# EAGLE board ControlBoard00_v04_NewNetNamesNewBackplanes (EAGLE 7.7.0), part 1 of 3
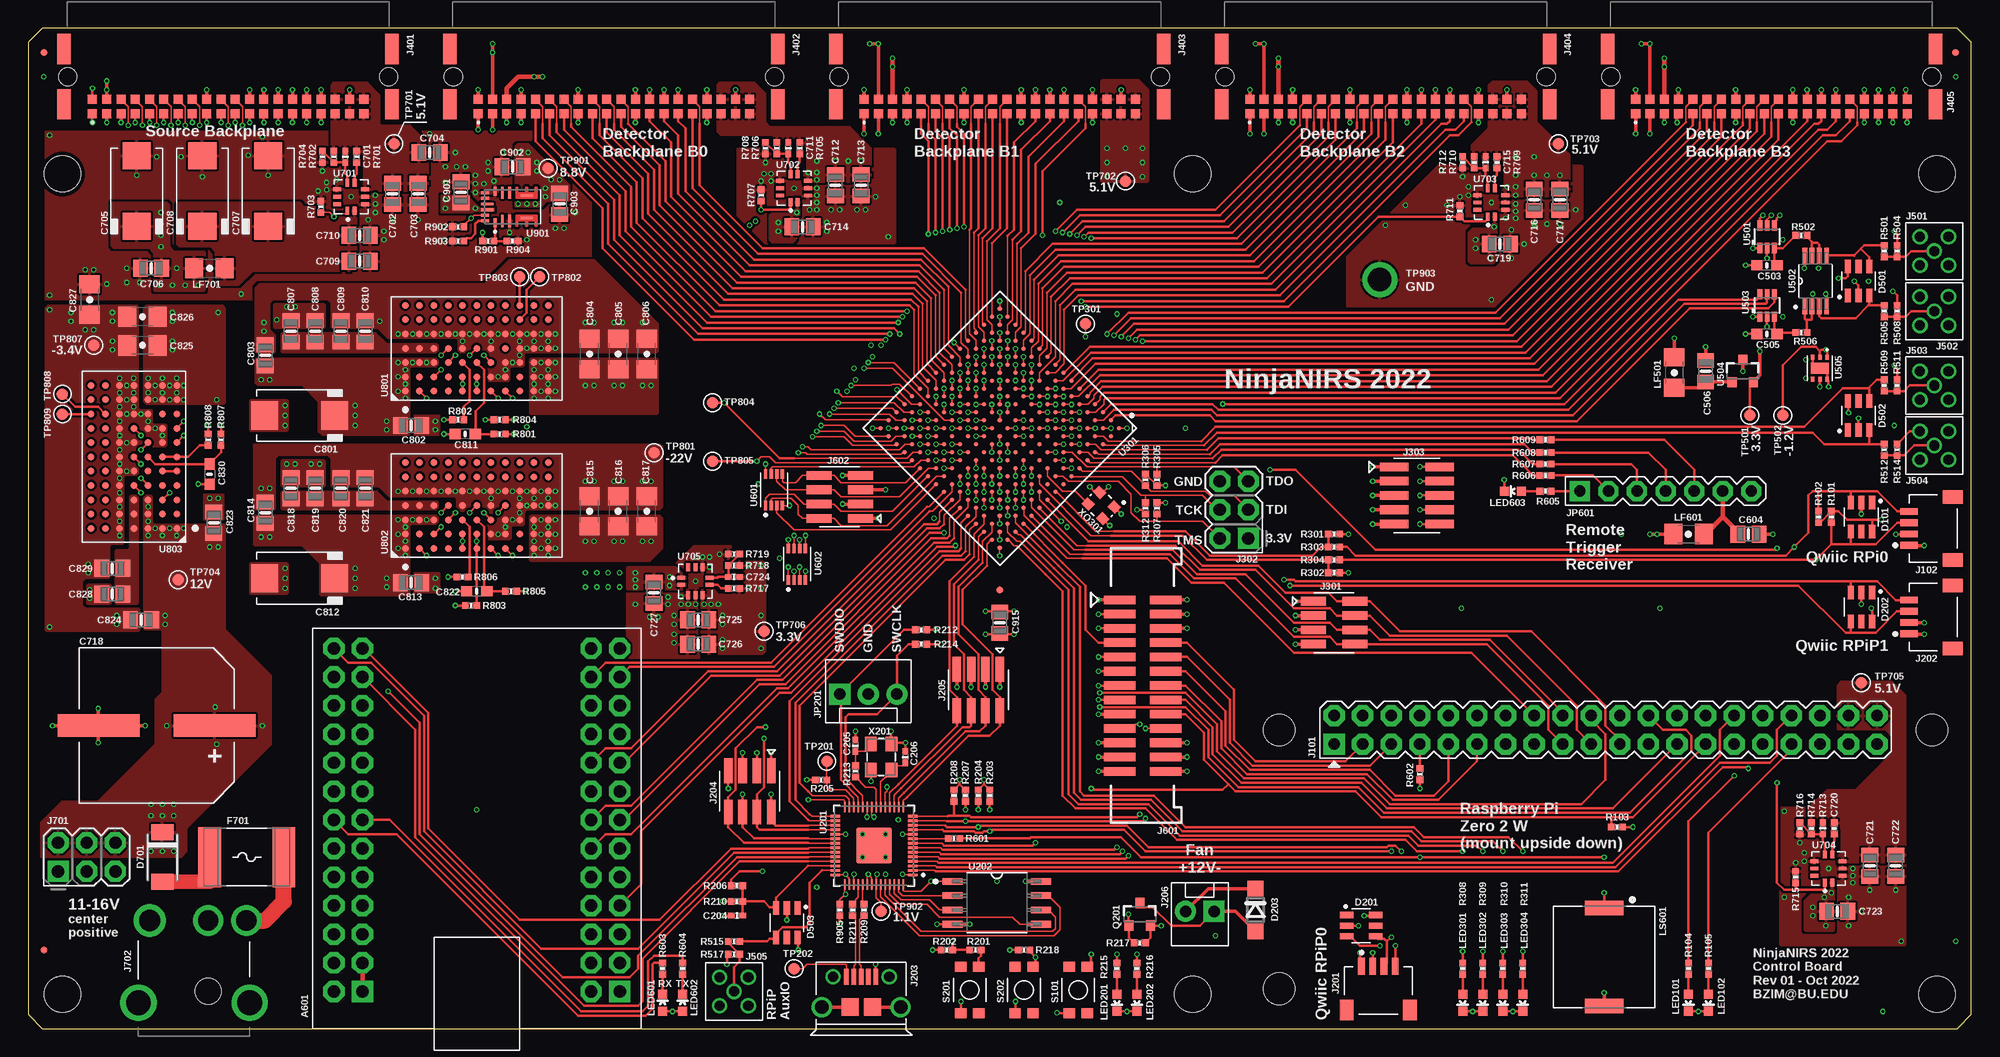
[diagram p9: board, top side]
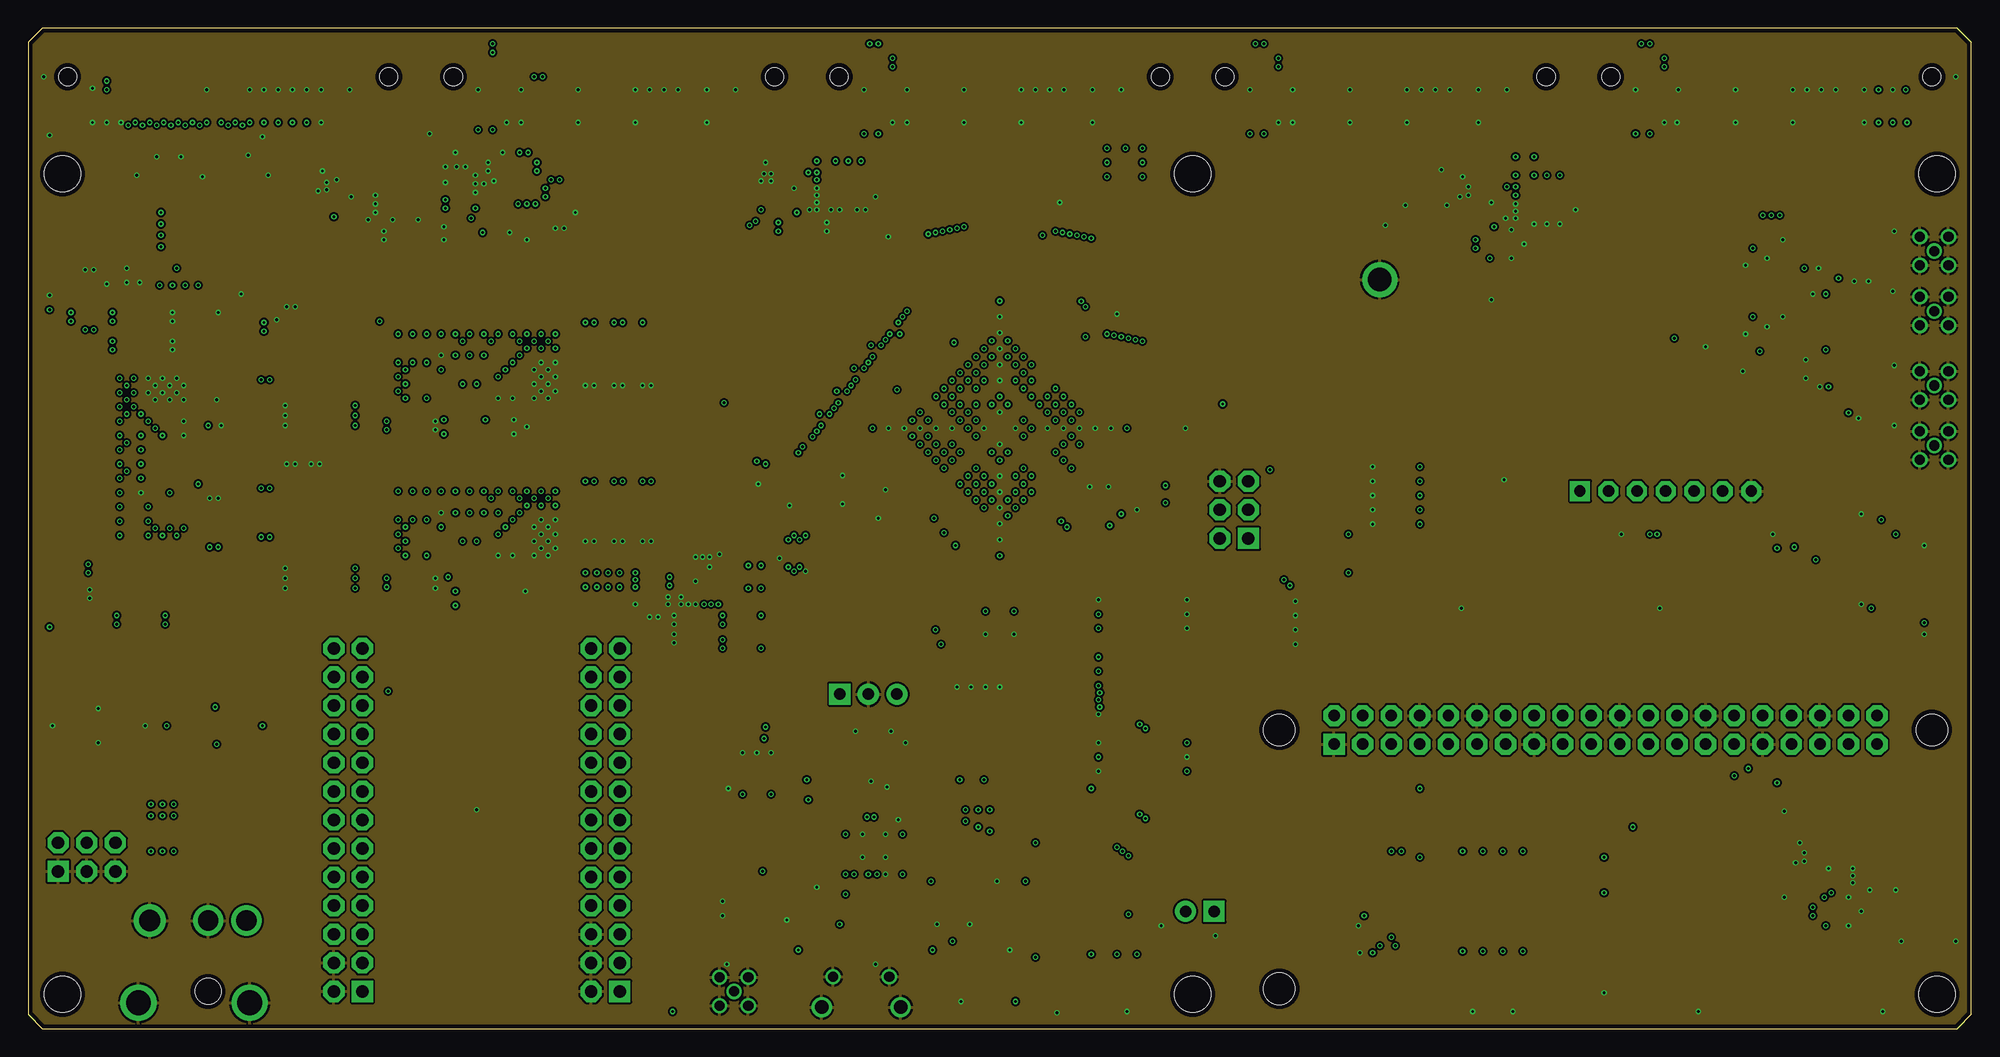
[diagram p10: board, inner layer Route2]
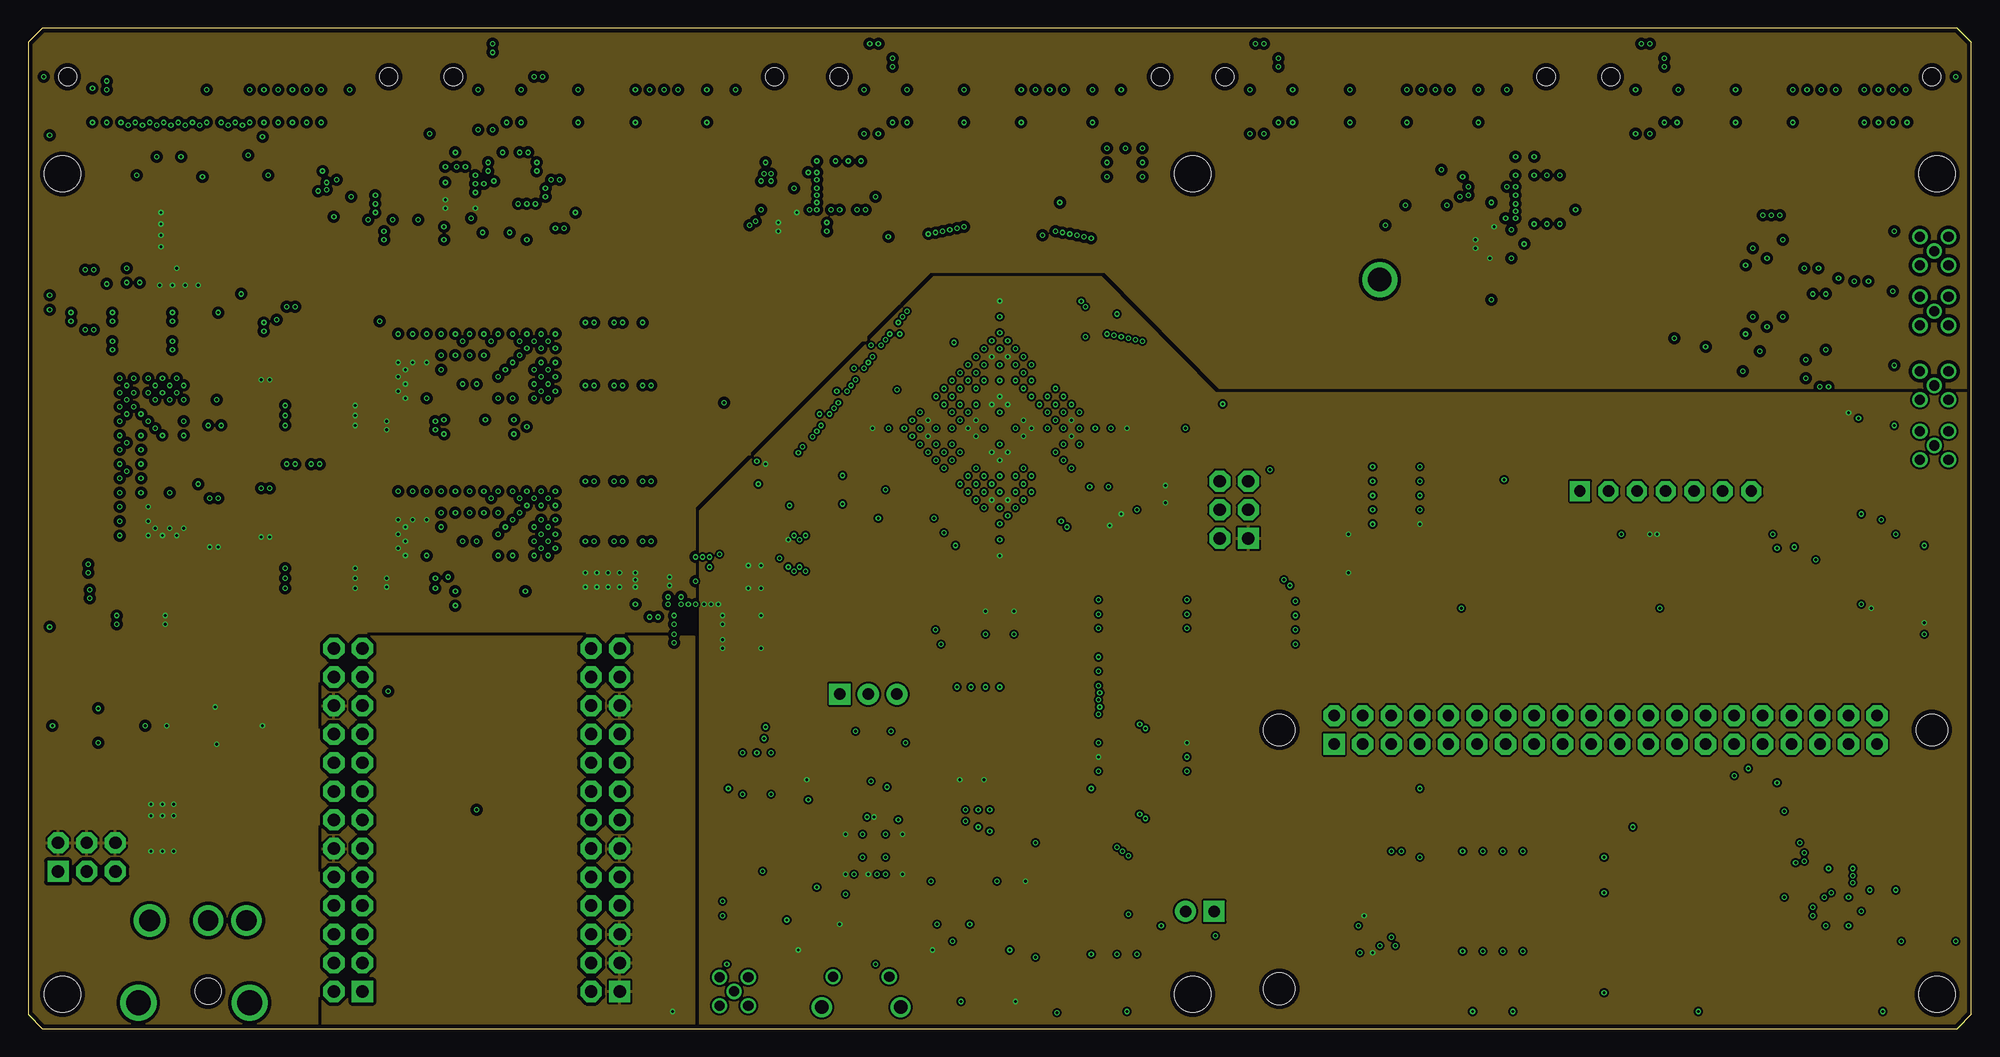
[diagram p11: board, inner layer Route3]
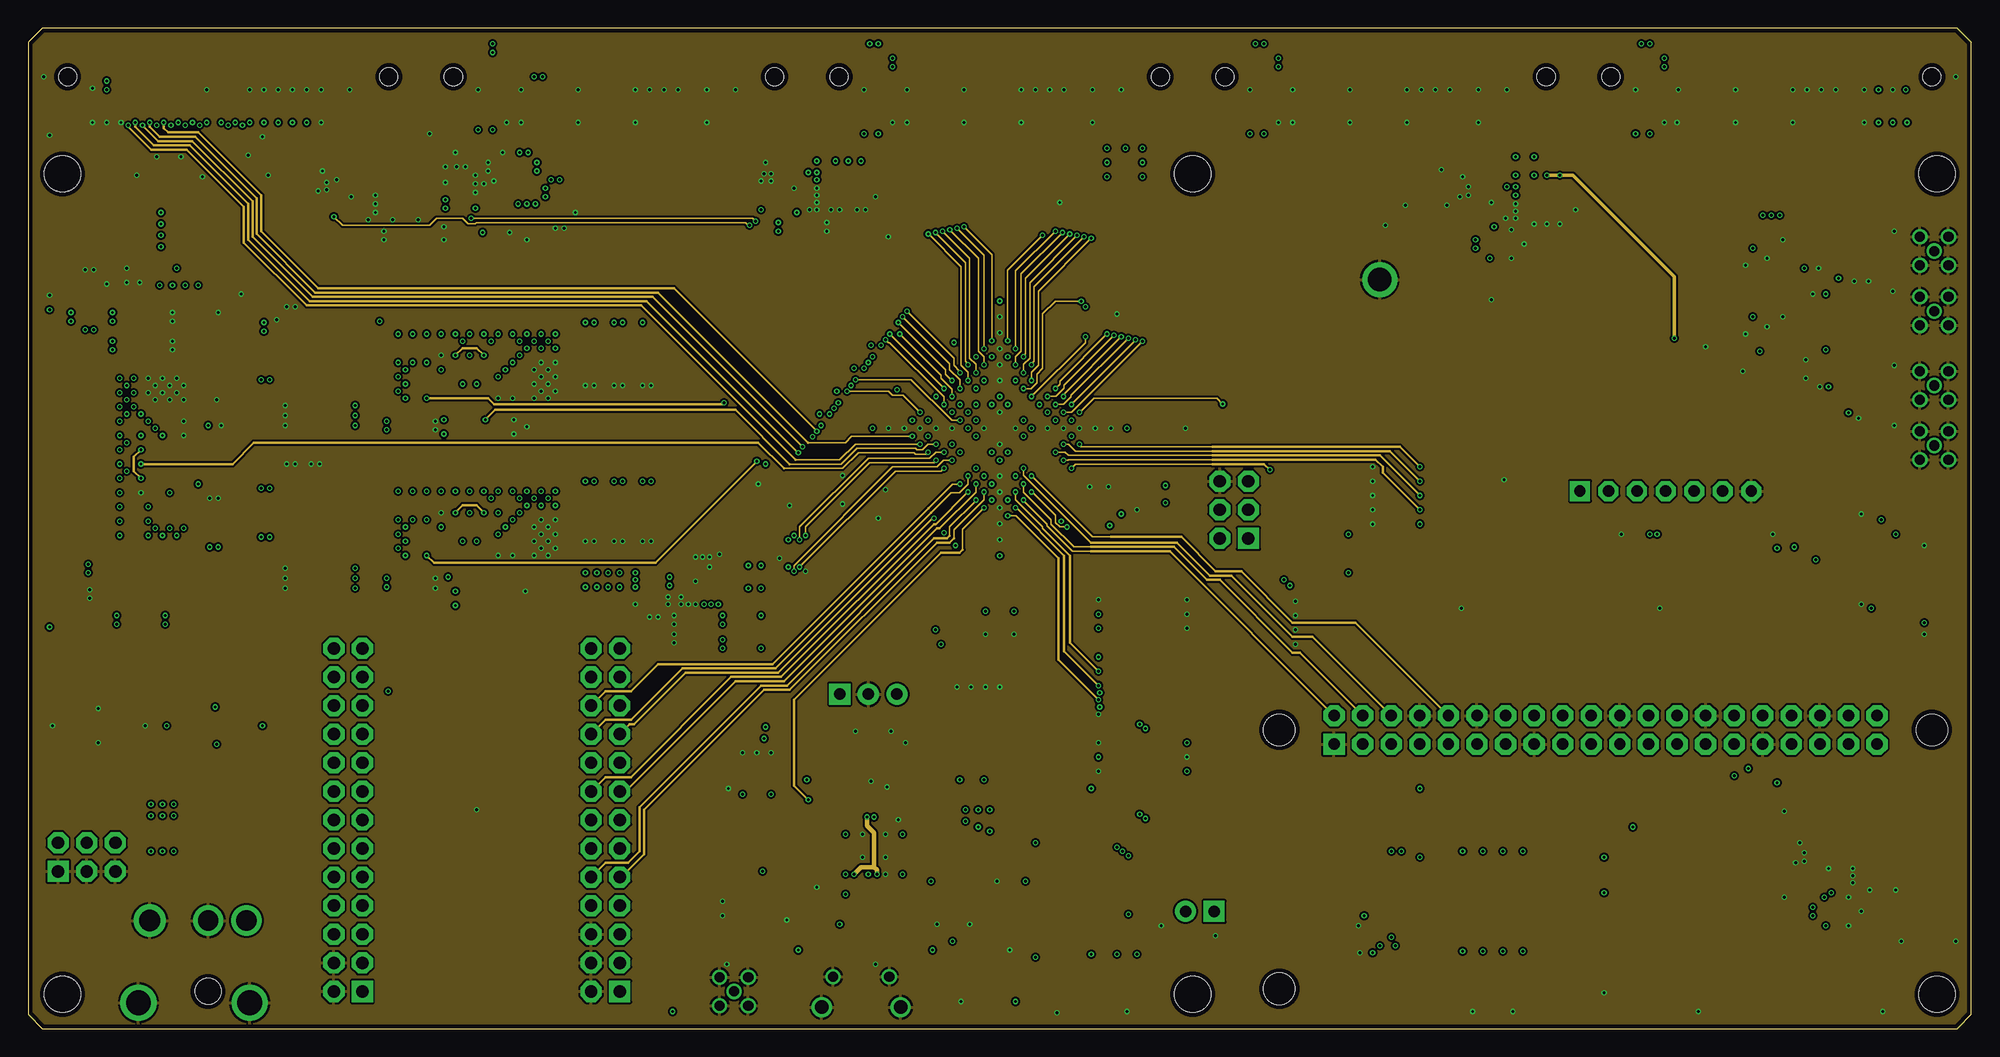
[diagram p12: board, inner layer Route14]
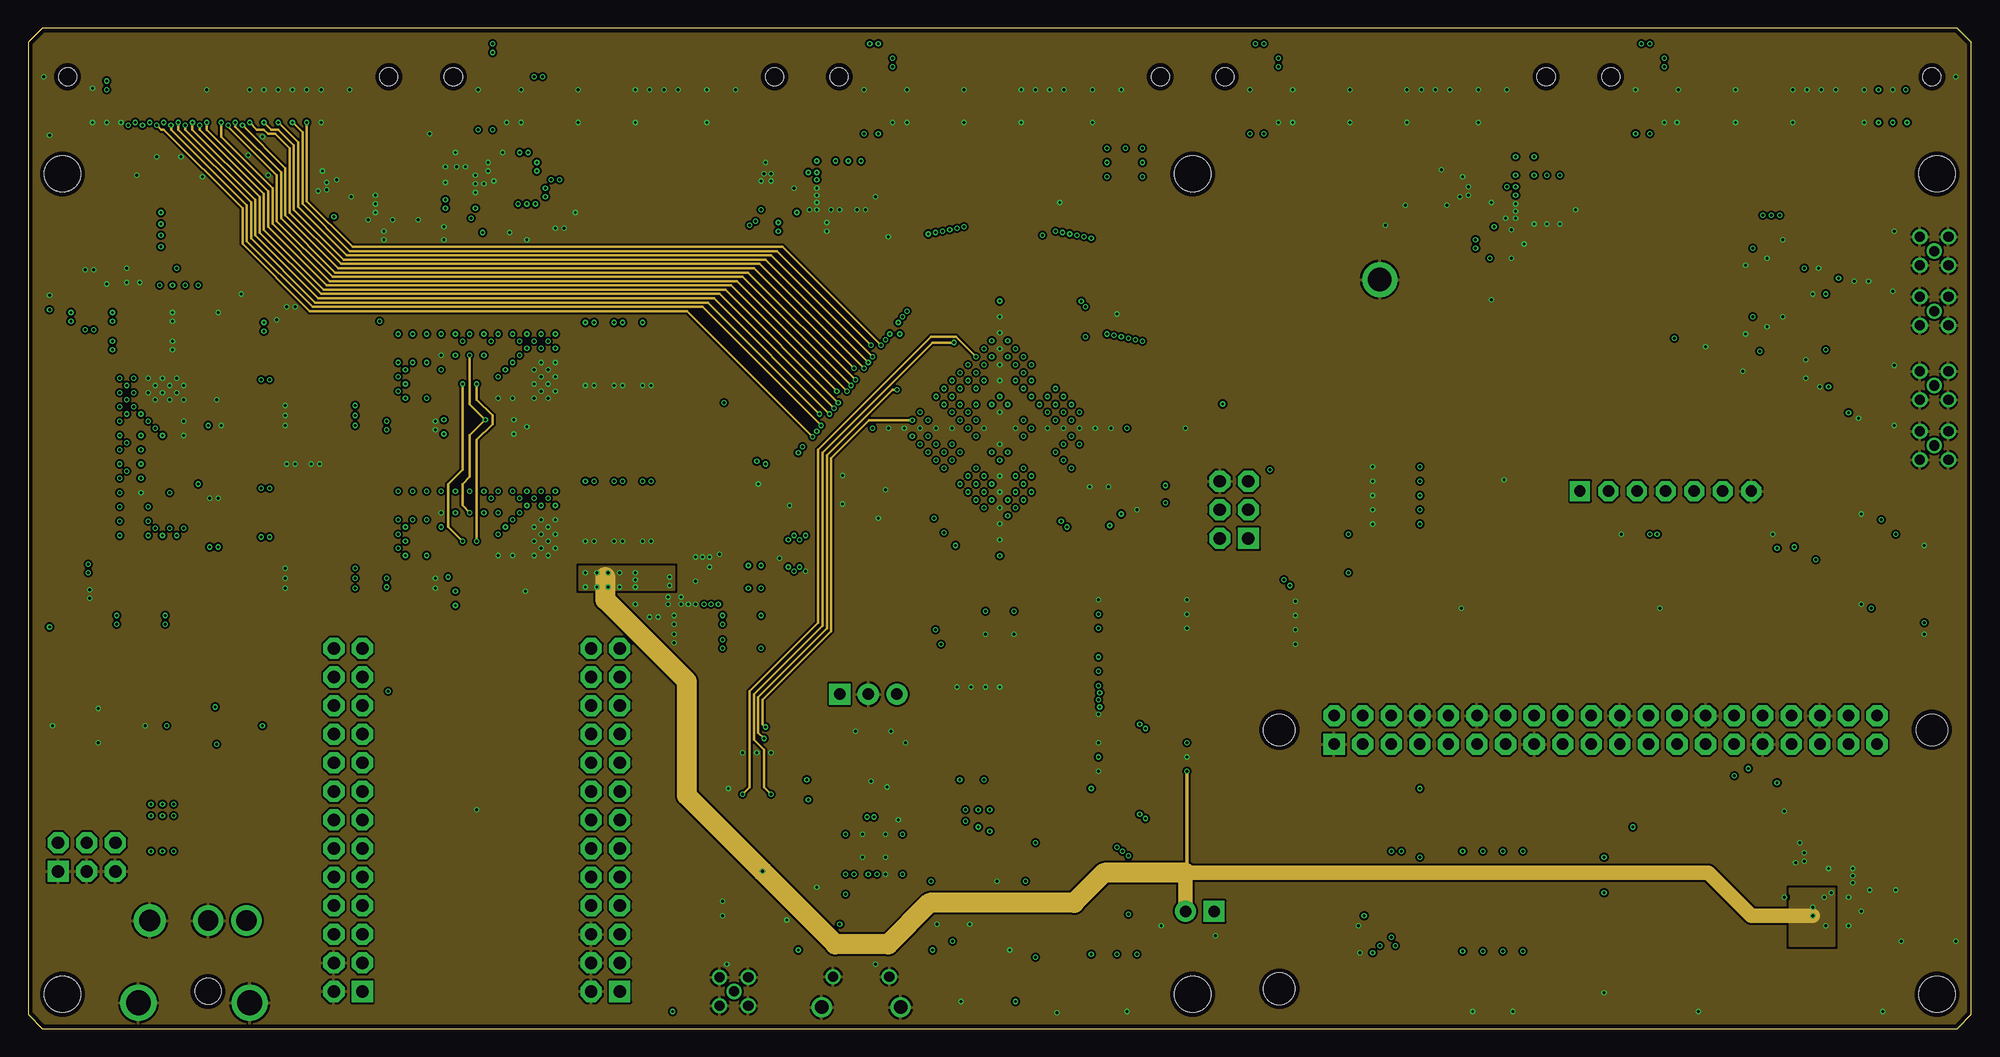
[diagram p13: board, inner layer Route15]
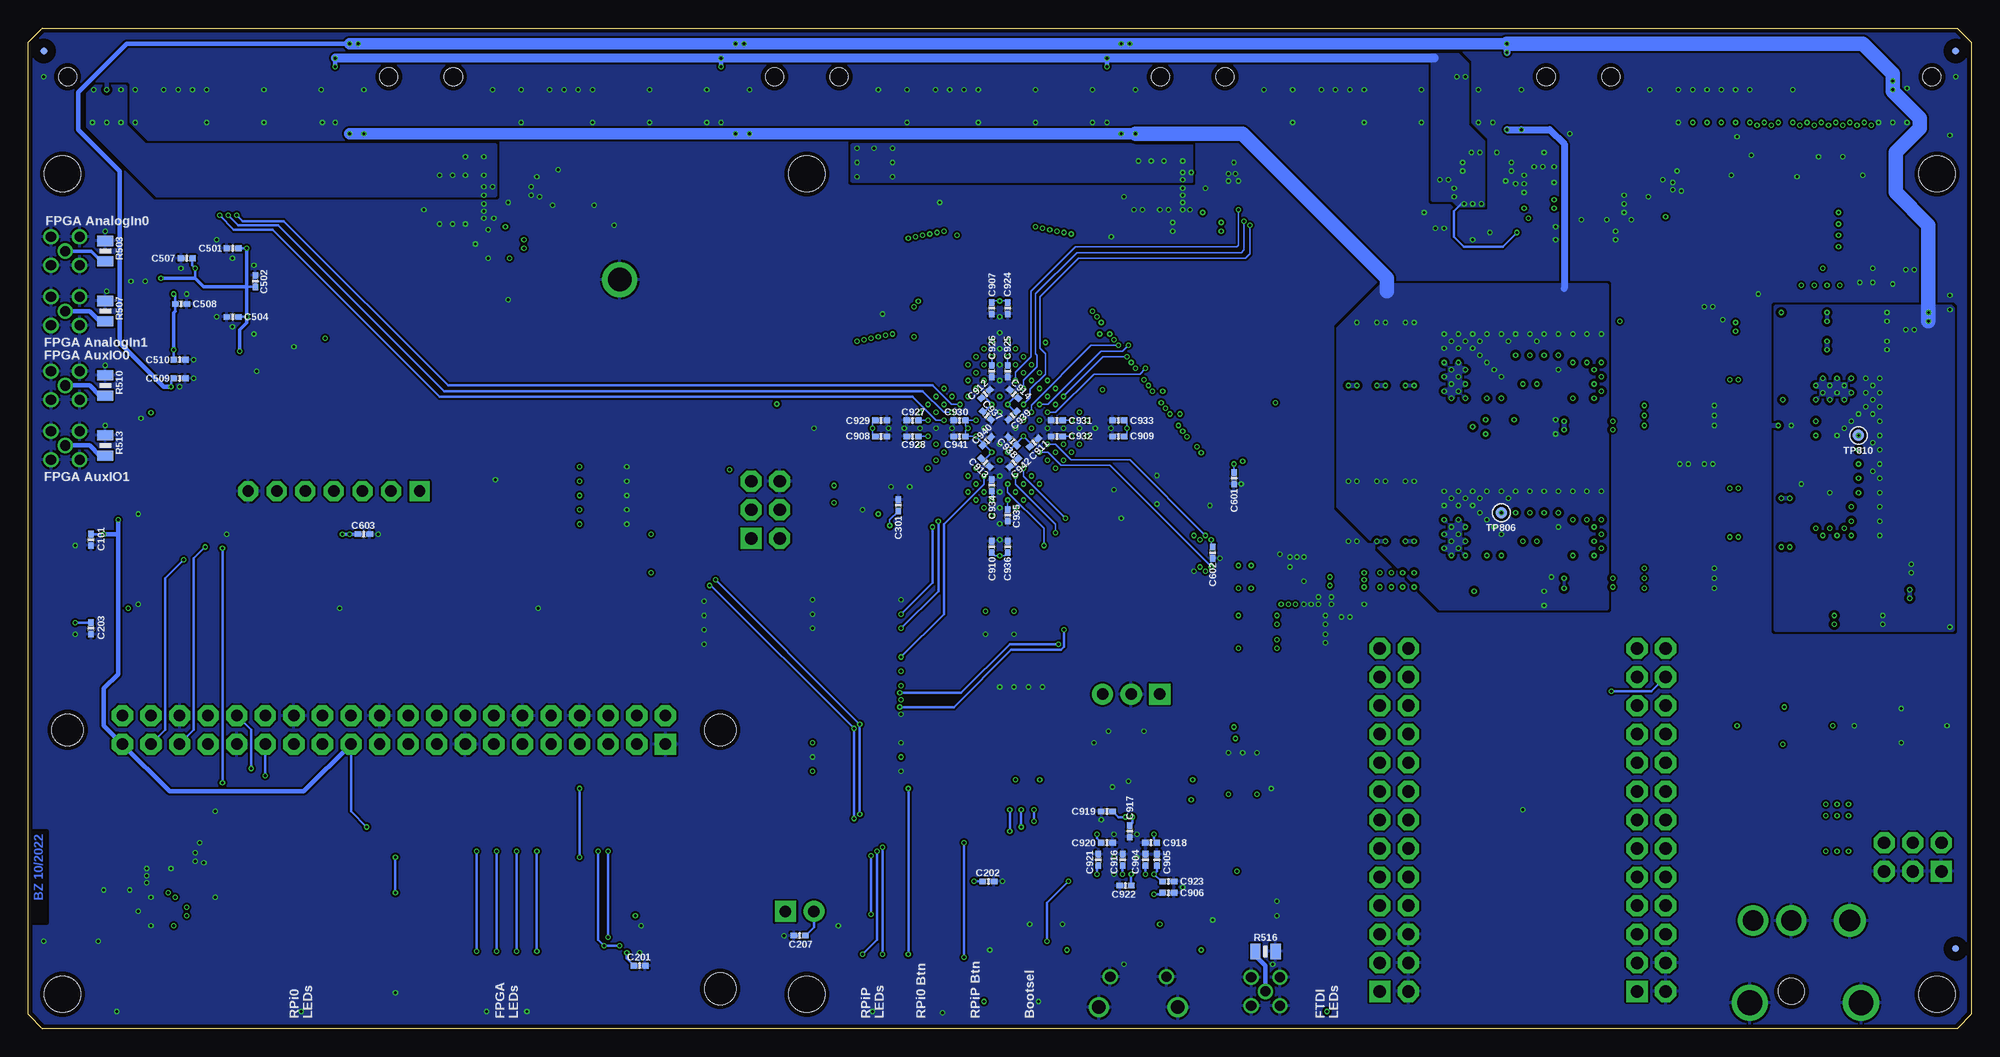
[diagram p14: board, bottom side, seen from below]

Size 172.72 x 88.9 mm. Coordinates in mm from the lower left corner, seen from the top.
Outline: 1.27,0 171.45,0 172.72,1.27 172.72,87.63 171.45,88.9 1.27,88.9 0,87.63 0,1.27 1.27,0
Copper layers (1*2*3*14*15*16): Top 0.04318125mm / dielectric 0.11074375mm / Route2 0.017271875mm / dielectric 4mil / Route3 0.017271875mm / dielectric 0.925575mm / Route14 0.017271875mm / dielectric 4mil / Route15 0.017271875mm / dielectric 0.11074375mm / Bottom 0.04318125mm
Design rules "ControlBoard00_v01_DRCsnapshot": minimum track width 5mil, minimum drill 10mil, track to track 5mil, track to pad 5mil, pad to pad 5mil, via to via 5mil, smd to smd 5mil, copper to edge 15mil, drill to drill 6mil, minimum pad ring 4mil, minimum via ring 4mil, stop-mask expansion 1.5mil, vias tented up to drill 12mil, thermal gap 8mil
Holes 3.2 mm at 3.05,3.05 169.67,3.05 103.5,3.05 3.05,75.95 103.5,75.95 169.67,75.95
Holes 2.8 mm at 111.21,26.54 169.21,26.54 111.21,3.54
tKeepout: area 100.5,72.9 to 106.6,79; area 166.6,72.9 to 172.7,79; area 0,72.9 to 6.1,79; area 0,0 to 6.1,6.1; area 100.5,0 to 106.6,6.1; area 166.6,0 to 172.7,6.1
tRestrict: 33 lines
bRestrict: 3 lines

## Footprints (pad centres in the part's own frame; a part is rotated, then mirrored left to right if it is on the bottom)
FT2232H-MINIMOD = drill 1.1 pad 1.88 square: CN2-1 -15.24,-12.7; CN3-1 -15.24,10.16 | drill 1.1 pad 1.88 octagon: CN2-2 -15.24,-10.16; CN2-3 -12.7,-12.7; CN2-4 -12.7,-10.16; CN2-5 -10.16,-12.7; CN2-6 -10.16,-10.16; CN2-7 -7.62,-12.7; CN2-8 -7.62,-10.16; CN2-9 -5.08,-12.7; CN2-10 -5.08,-10.16; CN2-11 -2.54,-12.7; CN2-12 -2.54,-10.16; CN2-13 0,-12.7; CN2-14 0,-10.16; CN2-15 2.54,-12.7; CN2-16 2.54,-10.16; CN2-17 5.08,-12.7; CN2-18 5.08,-10.16; CN2-19 7.62,-12.7; CN2-20 7.62,-10.16; CN2-21 10.16,-12.7; CN2-22 10.16,-10.16; CN2-23 12.7,-12.7; CN2-24 12.7,-10.16; CN2-25 15.24,-12.7; CN2-26 15.24,-10.16; CN3-2 -15.24,12.7; CN3-3 -12.7,10.16; CN3-4 -12.7,12.7; CN3-5 -10.16,10.16; CN3-6 -10.16,12.7; CN3-7 -7.62,10.16; CN3-8 -7.62,12.7; CN3-9 -5.08,10.16; CN3-10 -5.08,12.7; CN3-11 -2.54,10.16; CN3-12 -2.54,12.7; CN3-13 0,10.16; CN3-14 0,12.7; CN3-15 2.54,10.16; CN3-16 2.54,12.7; CN3-17 5.08,10.16; CN3-18 5.08,12.7; CN3-19 7.62,10.16; CN3-20 7.62,12.7; CN3-21 10.16,10.16; CN3-22 10.16,12.7; CN3-23 12.7,10.16; CN3-24 12.7,12.7; CN3-25 15.24,10.16; CN3-26 15.24,12.7
0402-CAP = smd 0.6 x 0.5: 1 -0.5,0; 2 0.5,0
0603-CAP = smd 1 x 0.9: 1 -0.9,0; 2 0.9,0
0805-CAP = smd 1.3 x 1.5: 1 -0.95,0; 2 0.95,0
2917-CAP = smd 2.4 x 2.5: N 3.125,0; P -3.125,0
CAP-SMD-POL-12.5 = smd 2 x 7.3: N 0,-5.15; P 0,5.15
1206 = smd 1.6 x 1.8: 1 -1.35,0; 2 1.35,0
SOT23-6 = smd 1.2 x 0.55: 1 -1.3,0.95; 2 -1.3,0; 3 -1.3,-0.95; 4 1.3,-0.95; 5 1.3,0; 6 1.3,0.95
SOD123 = smd 1.4 x 1.4: A 1.9,0; C -1.9,0
SOD128 = smd 1.4 x 2: A -2.2,0; C 2.2,0
2920-FUSE = smd 2.032 x 5.334: 1 -3.302,0; 2 3.302,0
MICRO-FIDUCIAL = smd 0.635 x 0.635: 1 0,0
M20X2_PTH = drill 1.016 pad 1.88 square: 1 -1.27,24.13 | drill 1.016 pad 1.88 octagon: 2 1.27,24.13; 3 -1.27,21.59; 4 1.27,21.59; 5 -1.27,19.05; 6 1.27,19.05; 7 -1.27,16.51; 8 1.27,16.51; 9 -1.27,13.97; 10 1.27,13.97; 11 -1.27,11.43; 12 1.27,11.43; 13 -1.27,8.89; 14 1.27,8.89; 15 -1.27,6.35; 16 1.27,6.35; 17 -1.27,3.81; 18 1.27,3.81; 19 -1.27,1.27; 20 1.27,1.27; 21 -1.27,-1.27; 22 1.27,-1.27; 23 -1.27,-3.81; 24 1.27,-3.81; 25 -1.27,-6.35; 26 1.27,-6.35; 27 -1.27,-8.89; 28 1.27,-8.89; 29 -1.27,-11.43; 30 1.27,-11.43; 31 -1.27,-13.97; 32 1.27,-13.97; 33 -1.27,-16.51; 34 1.27,-16.51; 35 -1.27,-19.05; 36 1.27,-19.05; 37 -1.27,-21.59; 38 1.27,-21.59; 39 -1.27,-24.13; 40 1.27,-24.13
M04X1_JST_SH_SM_RA = smd 0.6 x 1.55: 1 -1.5,4.775; 2 -0.5,4.775; 3 0.5,4.775; 4 1.5,4.775 | smd 1.2 x 1.8: PAD1 -2.8,0.9; PAD2 2.8,0.9
USB-MICRO = smd 0.4 x 1.4: 1 -1.3,2.7; 2 -0.65,2.7; 3 0,2.7; 4 0.65,2.7; 5 1.3,2.7 | drill 0.9: SH1 -2.5,2.7; SH2 2.5,2.7 | drill 1.2: SH3 -3.5,0; SH6 3.5,0 | smd 1.5 x 1.55: SH4 -1,0; SH5 1,0
M04X2_0.050_SMD_NO_CREAM = smd 2.21 x 0.762: 1 -1.841,1.905; 2 1.841,1.905; 3 -1.841,0.635; 4 1.841,0.635; 5 -1.841,-0.635; 6 1.841,-0.635; 7 -1.841,-1.905; 8 1.841,-1.905
MOLEX-1X2 = drill 1.016 pad 1.88 square: 1 0,0 | drill 1.016 pad 1.88: 2 2.54,0
2X3-NS = drill 1.1 pad 1.88 square: 1 -2.54,-1.27 | drill 1.1 pad 1.88 octagon: 2 -2.54,1.27; 3 0,-1.27; 4 0,1.27; 5 2.54,-1.27; 6 2.54,1.27
M05X2_0.050_SMD_NO_CREAM = smd 2.54 x 0.762: 1 -2.032,2.54; 2 2.032,2.54; 3 -2.032,1.27; 4 2.032,1.27; 5 -2.032,0; 6 2.032,0; 7 -2.032,-1.27; 8 2.032,-1.27; 9 -2.032,-2.54; 10 2.032,-2.54
M20X2_HARFLEX_M = smd 0.8 x 0.8: A1 12.065,2; A2 10.795,2; A3 9.525,2; A4 8.255,2; A5 6.985,2; A6 5.715,2; A7 4.445,2; A8 3.175,2; A9 1.905,2; A10 0.635,2; A11 -0.635,2; A12 -1.905,2; A13 -3.175,2; A14 -4.445,2; A15 -5.715,2; A16 -6.985,2; A17 -8.255,2; A18 -9.525,2; A19 -10.795,2; A20 -12.065,2; B1 12.065,3.27; B2 10.795,3.27; B3 9.525,3.27; B4 8.255,3.27; B5 6.985,3.27; B6 5.715,3.27; B7 4.445,3.27; B8 3.175,3.27; B9 1.905,3.27; B10 0.635,3.27; B11 -0.635,3.27; B12 -1.905,3.27; B13 -3.175,3.27; B14 -4.445,3.27; B15 -5.715,3.27; B16 -6.985,3.27; B17 -8.255,3.27; B18 -9.525,3.27; B19 -10.795,3.27; B20 -12.065,3.27 | smd 1.2 x 2.7: P$17 -14.575,2.45; P$18 -14.575,-2.45; P$19 14.575,2.45; P$20 14.575,-2.45 | hole 1.6: -14.275,0; 14.275,0
MMCX_PTH_STR = drill 0.9: C 0,0; G@1 -1.27,1.27; G@2 -1.27,-1.27; G@3 1.27,-1.27; G@4 1.27,1.27
M13X2_0.050_SHF = smd 2.794 x 0.762: 1 -2.032,7.62; 2 2.032,7.62; 3 -2.032,6.35; 4 2.032,6.35; 5 -2.032,5.08; 6 2.032,5.08; 7 -2.032,3.81; 8 2.032,3.81; 9 -2.032,2.54; 10 2.032,2.54; 11 -2.032,1.27; 12 2.032,1.27; 13 -2.032,0; 14 2.032,0; 15 -2.032,-1.27; 16 2.032,-1.27; 17 -2.032,-2.54; 18 2.032,-2.54; 19 -2.032,-3.81; 20 2.032,-3.81; 21 -2.032,-5.08; 22 2.032,-5.08; 23 -2.032,-6.35; 24 2.032,-6.35; 25 -2.032,-7.62; 26 2.032,-7.62
PJ051AH = drill 1.8: CENTER 6.3,-3.4; SWITCH 6.3,0 | drill 2.2: SHIELD1 -1,6.2; SHIELD2 -1,-3.7 | drill 1.9: SLEEVE 6.3,5.2 | hole 2.3: 0,0
MOLEX-1X3 = drill 1.016 pad 1.88 square: 1 0,0 | drill 1.016 pad 1.88: 2 2.54,0; 3 5.08,0
1X07 = drill 1.016 pad 1.778 square: 1 -7.62,0 | drill 1.016 pad 1.778 octagon: 2 -5.08,0; 3 -2.54,0; 4 0,0; 5 2.54,0; 6 5.08,0; 7 7.62,0
LED-0603 = smd 0.8 x 0.8: A 0,-0.75; C 0,0.75
XDCR_PKMCS0909E4000-R1 = smd 1.3 x 3.4: 1 -4.35,0; 2 4.35,0
SOT23-3 = smd 0.9 x 0.8: 1 -1,0.95; 2 -1,-0.95; 3 1,0
0402-RES = smd 0.6 x 0.6: 1 -0.5,0; 2 0.5,0
0805 = smd 0.9 x 1.4: 1 -0.9,0; 2 0.9,0
TACTILE_SWITCH_SMD-3 = smd 0.9 x 1: 1 -2.05,0.8; 2 2.05,0.8; 3 -2.05,-0.8; 4 2.05,-0.8
TESTPAD_ROUND = smd 1.016 x 1.016: P$1 0,0
TURRET = drill 2.08: P$1 0,0
QFN-56_EP = smd 0.875 x 0.2: 1 -3.438,2.6; 2 -3.438,2.2; 3 -3.438,1.8; 4 -3.438,1.4; 5 -3.438,1; 6 -3.438,0.6; 7 -3.438,0.2; 8 -3.438,-0.2; 9 -3.438,-0.6; 10 -3.438,-1; 11 -3.438,-1.4; 12 -3.438,-1.8; 13 -3.438,-2.2; 14 -3.438,-2.6; 29 3.438,-2.6; 30 3.438,-2.2; 31 3.438,-1.8; 32 3.438,-1.4; 33 3.438,-1; 34 3.438,-0.6; 35 3.438,-0.2; 36 3.438,0.2; 37 3.438,0.6; 38 3.438,1; 39 3.438,1.4; 40 3.438,1.8; 41 3.438,2.2; 42 3.438,2.6 | smd 0.2 x 0.875: 15 -2.6,-3.438; 16 -2.2,-3.438; 17 -1.8,-3.438; 18 -1.4,-3.438; 19 -1,-3.438; 20 -0.6,-3.438; 21 -0.2,-3.438; 22 0.2,-3.438; 23 0.6,-3.438; 24 1,-3.438; 25 1.4,-3.438; 26 1.8,-3.438; 27 2.2,-3.438; 28 2.6,-3.438; 43 2.6,3.438; 44 2.2,3.438; 45 1.8,3.438; 46 1.4,3.438; 47 1,3.438; 48 0.6,3.438; 49 0.2,3.438; 50 -0.2,3.438; 51 -0.6,3.438; 52 -1,3.438; 53 -1.4,3.438; 54 -1.8,3.438; 55 -2.2,3.438; 56 -2.6,3.438 | smd 3.2 x 3.2: PAD 0,0
SO08-208MIL = smd 1.778 x 0.584: 1 -3.937,1.905; 2 -3.937,0.635; 3 -3.937,-0.635; 4 -3.937,-1.905; 5 3.937,-1.905; 6 3.937,-0.635; 7 3.937,0.635; 8 3.937,1.905
LBGA-256 = smd 0.4 x 0.4: A1 -7.5,7.5; A2 -6.5,7.5; A3 -5.5,7.5; A4 -4.5,7.5; A5 -3.5,7.5; A6 -2.5,7.5; A7 -1.5,7.5; A8 -0.5,7.5; A9 0.5,7.5; A10 1.5,7.5; A11 2.5,7.5; A12 3.5,7.5; A13 4.5,7.5; A14 5.5,7.5; A15 6.5,7.5; A16 7.5,7.5; B1 -7.5,6.5; B2 -6.5,6.5; B3 -5.5,6.5; B4 -4.5,6.5; B5 -3.5,6.5; B6 -2.5,6.5; B7 -1.5,6.5; B8 -0.5,6.5; B9 0.5,6.5; B10 1.5,6.5; B11 2.5,6.5; B12 3.5,6.5; B13 4.5,6.5; B14 5.5,6.5; B15 6.5,6.5; B16 7.5,6.5; C1 -7.5,5.5; C2 -6.5,5.5; C3 -5.5,5.5; C4 -4.5,5.5; C5 -3.5,5.5; C6 -2.5,5.5; C7 -1.5,5.5; C8 -0.5,5.5; C9 0.5,5.5; C10 1.5,5.5; C11 2.5,5.5; C12 3.5,5.5; C13 4.5,5.5; C14 5.5,5.5; C15 6.5,5.5; C16 7.5,5.5; D1 -7.5,4.5; D2 -6.5,4.5; D3 -5.5,4.5; D4 -4.5,4.5; D5 -3.5,4.5; D6 -2.5,4.5; D7 -1.5,4.5; D8 -0.5,4.5; D9 0.5,4.5; D10 1.5,4.5; D11 2.5,4.5; D12 3.5,4.5; D13 4.5,4.5; D14 5.5,4.5; D15 6.5,4.5; D16 7.5,4.5; E1 -7.5,3.5; E2 -6.5,3.5; E3 -5.5,3.5; E4 -4.5,3.5; E5 -3.5,3.5; E6 -2.5,3.5; E7 -1.5,3.5; E8 -0.5,3.5; E9 0.5,3.5; E10 1.5,3.5; E11 2.5,3.5; E12 3.5,3.5; E13 4.5,3.5; E14 5.5,3.5; E15 6.5,3.5; E16 7.5,3.5; F1 -7.5,2.5; F2 -6.5,2.5; F3 -5.5,2.5; F4 -4.5,2.5; F5 -3.5,2.5; F6 -2.5,2.5; F7 -1.5,2.5; F8 -0.5,2.5; F9 0.5,2.5; F10 1.5,2.5; F11 2.5,2.5; F12 3.5,2.5; F13 4.5,2.5; F14 5.5,2.5; F15 6.5,2.5; F16 7.5,2.5; G1 -7.5,1.5; G2 -6.5,1.5; G3 -5.5,1.5; G4 -4.5,1.5; G5 -3.5,1.5; G6 -2.5,1.5; G7 -1.5,1.5; G8 -0.5,1.5; G9 0.5,1.5; G10 1.5,1.5; G11 2.5,1.5; G12 3.5,1.5; G13 4.5,1.5; G14 5.5,1.5; G15 6.5,1.5; G16 7.5,1.5; H1 -7.5,0.5; H2 -6.5,0.5; H3 -5.5,0.5; H4 -4.5,0.5; H5 -3.5,0.5; H6 -2.5,0.5; H7 -1.5,0.5; H8 -0.5,0.5; H9 0.5,0.5; H10 1.5,0.5; H11 2.5,0.5; H12 3.5,0.5; H13 4.5,0.5; H14 5.5,0.5; H15 6.5,0.5; H16 7.5,0.5; J1 -7.5,-0.5; J2 -6.5,-0.5; J3 -5.5,-0.5; J4 -4.5,-0.5; J5 -3.5,-0.5; J6 -2.5,-0.5; J7 -1.5,-0.5; J8 -0.5,-0.5; J9 0.5,-0.5; J10 1.5,-0.5; J11 2.5,-0.5; J12 3.5,-0.5; J13 4.5,-0.5; J14 5.5,-0.5; J15 6.5,-0.5; J16 7.5,-0.5; K1 -7.5,-1.5; K2 -6.5,-1.5; K3 -5.5,-1.5; K4 -4.5,-1.5; K5 -3.5,-1.5; K6 -2.5,-1.5; K7 -1.5,-1.5; K8 -0.5,-1.5; K9 0.5,-1.5; K10 1.5,-1.5; K11 2.5,-1.5; K12 3.5,-1.5; K13 4.5,-1.5; K14 5.5,-1.5; K15 6.5,-1.5; K16 7.5,-1.5; L1 -7.5,-2.5; L2 -6.5,-2.5; L3 -5.5,-2.5; L4 -4.5,-2.5; L5 -3.5,-2.5; L6 -2.5,-2.5; L7 -1.5,-2.5; L8 -0.5,-2.5; L9 0.5,-2.5; L10 1.5,-2.5; L11 2.5,-2.5; L12 3.5,-2.5; L13 4.5,-2.5; L14 5.5,-2.5; L15 6.5,-2.5; L16 7.5,-2.5; M1 -7.5,-3.5; M2 -6.5,-3.5; M3 -5.5,-3.5; M4 -4.5,-3.5; M5 -3.5,-3.5; M6 -2.5,-3.5; M7 -1.5,-3.5; M8 -0.5,-3.5; M9 0.5,-3.5; M10 1.5,-3.5; M11 2.5,-3.5; M12 3.5,-3.5; M13 4.5,-3.5; M14 5.5,-3.5; M15 6.5,-3.5; M16 7.5,-3.5; N1 -7.5,-4.5; N2 -6.5,-4.5; N3 -5.5,-4.5; N4 -4.5,-4.5; N5 -3.5,-4.5; N6 -2.5,-4.5; N7 -1.5,-4.5; N8 -0.5,-4.5; N9 0.5,-4.5; N10 1.5,-4.5; N11 2.5,-4.5; N12 3.5,-4.5; N13 4.5,-4.5; N14 5.5,-4.5; N15 6.5,-4.5; N16 7.5,-4.5; P1 -7.5,-5.5; P2 -6.5,-5.5; P3 -5.5,-5.5; P4 -4.5,-5.5; P5 -3.5,-5.5; P6 -2.5,-5.5; P7 -1.5,-5.5; P8 -0.5,-5.5; P9 0.5,-5.5; P10 1.5,-5.5; P11 2.5,-5.5; P12 3.5,-5.5; P13 4.5,-5.5; P14 5.5,-5.5; P15 6.5,-5.5; P16 7.5,-5.5; R1 -7.5,-6.5; R2 -6.5,-6.5; R3 -5.5,-6.5; R4 -4.5,-6.5; R5 -3.5,-6.5; R6 -2.5,-6.5; R7 -1.5,-6.5; R8 -0.5,-6.5; R9 0.5,-6.5; R10 1.5,-6.5; R11 2.5,-6.5; R12 3.5,-6.5; R13 4.5,-6.5; R14 5.5,-6.5; R15 6.5,-6.5; R16 7.5,-6.5; T1 -7.5,-7.5; T2 -6.5,-7.5; T3 -5.5,-7.5; T4 -4.5,-7.5; T5 -3.5,-7.5; T6 -2.5,-7.5; T7 -1.5,-7.5; T8 -0.5,-7.5; T9 0.5,-7.5; T10 1.5,-7.5; T11 2.5,-7.5; T12 3.5,-7.5; T13 4.5,-7.5; T14 5.5,-7.5; T15 6.5,-7.5; T16 7.5,-7.5
SOT363 = smd 0.42 x 0.9: 1 -0.65,-1; 2 0,-1; 3 0.65,-1; 4 0.65,1; 5 0,1; 6 -0.65,1
SOP65P490X110-8N = smd 1.397 x 0.432: 1 -2.261,0.975; 2 -2.261,0.325; 3 -2.261,-0.325; 4 -2.261,-0.975; 5 2.261,-0.975; 6 2.261,-0.325; 7 2.261,0.325; 8 2.261,0.975
WSON6 = smd 0.45 x 0.3: 1 -0.975,0.65; 2 -0.975,0; 3 -0.975,-0.65; 4 0.975,-0.65; 5 0.975,0; 6 0.975,0.65 | smd 1 x 1.6: PAD 0,0
USON8L-2X3MM = smd 0.85 x 0.3: 1 -1.4,0.75; 2 -1.4,0.25; 3 -1.4,-0.25; 4 -1.4,-0.75; 5 1.4,-0.75; 6 1.4,-0.25; 7 1.4,0.25; 8 1.4,0.75
RPL-30 = smd 0.7 x 0.35: 1 -1.25,0.325; 2 -1.25,-0.325; 6 1.25,-0.325; 7 1.25,0.325 | smd 0.35 x 0.7: 3 -0.65,-1.25; 4 0,-1.25; 5 0.65,-1.25; 8 0.65,1.25; 9 0,1.25; 10 -0.65,1.25
BGA-77 = smd 0.63 x 0.63: A1 -3.81,6.35; A2 -2.54,6.35; A3 -1.27,6.35; A4 0,6.35; A5 1.27,6.35; A6 2.54,6.35; A7 3.81,6.35; B1 -3.81,5.08; B2 -2.54,5.08; B3 -1.27,5.08; B4 0,5.08; B5 1.27,5.08; B6 2.54,5.08; B7 3.81,5.08; C1 -3.81,3.81; C2 -2.54,3.81; C3 -1.27,3.81; C4 0,3.81; C5 1.27,3.81; C6 2.54,3.81; C7 3.81,3.81; D1 -3.81,2.54; D2 -2.54,2.54; D3 -1.27,2.54; D4 0,2.54; D5 1.27,2.54; D6 2.54,2.54; D7 3.81,2.54; E1 -3.81,1.27; E2 -2.54,1.27; E3 -1.27,1.27; E4 0,1.27; E5 1.27,1.27; E6 2.54,1.27; E7 3.81,1.27; F1 -3.81,0; F2 -2.54,0; F3 -1.27,0; F4 0,0; F5 1.27,0; F6 2.54,0; F7 3.81,0; G1 -3.81,-1.27; G2 -2.54,-1.27; G3 -1.27,-1.27; G4 0,-1.27; G5 1.27,-1.27; G6 2.54,-1.27; G7 3.81,-1.27; H1 -3.81,-2.54; H2 -2.54,-2.54; H3 -1.27,-2.54; H4 0,-2.54; H5 1.27,-2.54; H6 2.54,-2.54; H7 3.81,-2.54; J1 -3.81,-3.81; J2 -2.54,-3.81; J3 -1.27,-3.81; J4 0,-3.81; J5 1.27,-3.81; J6 2.54,-3.81; J7 3.81,-3.81; K1 -3.81,-5.08; K2 -2.54,-5.08; K3 -1.27,-5.08; K4 0,-5.08; K5 1.27,-5.08; K6 2.54,-5.08; K7 3.81,-5.08; L1 -3.81,-6.35; L2 -2.54,-6.35; L3 -1.27,-6.35; L4 0,-6.35; L5 1.27,-6.35; L6 2.54,-6.35; L7 3.81,-6.35
QFN-20-MPS_FULL_CREAM = smd 0.8 x 0.25: 1 -1.4,1.55; 12 1.4,1.55 | smd 1.1 x 0.25: 2 -1.25,0.9; 3 -1.25,0.25; 10 1.25,0.25; 11 1.25,0.9 | smd 0.25 x 1.1: 4_5_6 -1,-1.25; 7_8_9 1,-1.25; 15 0.25,2.25; 16 -0.25,2.25 | smd 0.25 x 0.7: 13 1.25,2.45; 14 0.75,2.45; 17 -0.75,2.45; 18 -1.25,2.45
CRYSTAL-3.2-2.5 = smd 1.3 x 1.05: 1 -1.15,-0.925; 2 1.15,-0.925; 3 1.15,0.925; 4 -1.15,0.925
TXO2520 = smd 0.9 x 0.8: 1 -0.925,-0.725; 2 0.925,-0.725; 3 0.925,0.725; 4 -0.925,0.725

## Placement (x,y rotation side)
A601  FT2232H-MINIMOD  [FT2232H-MINIMOD]  39.88,18.54 90 top
C101  0.1u  [0402-CAP]  167.13,43.43 270 bottom
C201  0.1u  [0402-CAP]  118.36,5.59 0 bottom
C202  0.1u  [0402-CAP]  87.38,13.08 0 bottom
C203  0.1u  [0402-CAP]  167.13,35.56 270 bottom
C204  0.1u  [0402-CAP]  62.99,10.03 180 top
C205  27p  [0402-CAP]  73.53,25.15 90 top
C206  27p  [0402-CAP]  77.98,24.13 90 top
C207  0.1u  [0402-CAP]  104.14,8.26 180 bottom
C301  0.1u  [0402-CAP]  95.38,46.48 90 bottom
C501  0.1u  [0402-CAP]  154.56,69.34 180 bottom
C502  4.7u  [0402-CAP]  152.53,66.42 90 bottom
C503  18n  [0603-CAP]  154.56,67.82 180 top
C504  0.1u  [0402-CAP]  154.56,63.25 180 bottom
C505  18n  [0603-CAP]  154.56,61.72 180 top
C506  22u  [0805-CAP]  149.1,58.42 90 top
C507  0.1u  [0402-CAP]  158.62,68.45 180 bottom
C508  0.1u  [0402-CAP]  159.13,64.39 180 bottom
C509  4.7u  [0402-CAP]  159.26,57.78 180 bottom
C510  4.7u  [0402-CAP]  159.26,59.44 180 bottom
C601  0.1u  [0402-CAP]  65.53,48.9 270 bottom
C602  0.1u  [0402-CAP]  67.44,42.29 270 bottom
C603  0.1u  [0402-CAP]  142.88,43.94 0 bottom
C604  22u  [0805-CAP]  152.91,43.94 0 top
C701  39p  [0402-CAP]  28.19,77.47 270 top
C702  22u  [0805-CAP]  32.38,74.17 270 top
C703  22u  [0805-CAP]  34.67,74.17 270 top
C704  22u  [0805-CAP]  35.69,77.85 0 top
C705  100u/25V  [2917-CAP]  9.65,74.42 90 top
C706  22u  [0805-CAP]  10.92,67.56 180 top
C707  100u/25V  [2917-CAP]  21.34,74.42 90 top
C708  100u/25V  [2917-CAP]  15.49,74.42 90 top
C709  22u  [0805-CAP]  29.46,68.2 0 top
C710  22u  [0805-CAP]  29.46,70.48 0 top
C711  39p  [0402-CAP]  67.56,78.23 270 top
C712  22u  [0805-CAP]  71.75,74.93 270 top
C713  22u  [0805-CAP]  74.04,74.93 270 top
C714  22u  [0805-CAP]  68.83,71.25 0 top
C715  39p  [0402-CAP]  129.54,76.96 270 top
C716  22u  [0805-CAP]  133.86,73.66 270 top
C717  22u  [0805-CAP]  136.14,73.66 270 top
C718  470u/25V  [CAP-SMD-POL-12.5]  11.43,26.92 270 top
C719  22u  [0805-CAP]  130.81,69.72 0 top
C720  39p  [0402-CAP]  159.51,17.78 270 top
C721  22u  [0805-CAP]  163.7,14.48 270 top
C722  22u  [0805-CAP]  165.99,14.48 270 top
C723  22u  [0805-CAP]  160.78,10.41 0 top
C724  39p  [0402-CAP]  62.74,40.13 180 top
C725  22u  [0805-CAP]  59.56,36.32 180 top
C726  22u  [0805-CAP]  59.56,34.16 180 top
C727  22u  [0805-CAP]  55.63,38.73 270 top
C801  100u/25V  [2917-CAP]  24.13,54.48 180 top
C802  4.7u  [0805-CAP]  34.04,53.59 0 top
C803  4.7u  [0805-CAP]  21.08,59.82 90 top
C804  10u  [1206]  49.91,59.94 90 top
C805  10u  [1206]  52.45,59.94 90 top
C806  10u  [1206]  54.99,59.94 90 top
C807  4.7u  [0805-CAP]  23.37,61.98 90 top
C808  4.7u  [0805-CAP]  25.53,61.98 90 top
C809  4.7u  [0805-CAP]  27.81,61.98 90 top
C810  4.7u  [0805-CAP]  29.97,61.98 90 top
C811  1u  [0603-CAP]  38.86,52.83 180 top
C812  100u/25V  [2917-CAP]  24.13,40.01 180 top
C813  4.7u  [0805-CAP]  34.04,39.62 0 top
C814  4.7u  [0805-CAP]  21.08,45.85 90 top
C815  10u  [1206]  49.91,45.97 90 top
C816  10u  [1206]  52.45,45.97 90 top
C817  10u  [1206]  54.99,45.97 90 top
C818  4.7u  [0805-CAP]  23.37,48.01 90 top
C819  4.7u  [0805-CAP]  25.53,48.01 90 top
C820  4.7u  [0805-CAP]  27.81,48.01 90 top
C821  4.7u  [0805-CAP]  29.97,48.01 90 top
C822  1u  [0603-CAP]  39.88,38.86 180 top
C823  4.7u  [0805-CAP]  16.51,44.96 90 top
C824  4.7u  [0805-CAP]  10.03,36.32 180 top
C825  100u  [1206]  10.16,60.71 180 top
C826  100u  [1206]  10.16,63.25 180 top
C827  DNP  [1206]  5.46,64.77 270 top
C828  4.7u  [0805-CAP]  7.49,38.61 180 top
C829  4.7u  [0805-CAP]  7.49,40.89 180 top
C830  1u  [0603-CAP]  16.13,49.28 270 top
C901  22u  [0805-CAP]  38.48,74.3 90 top
C902  22u  [0805-CAP]  43.05,76.58 180 top
C903  22u  [0805-CAP]  47.24,73.28 270 top
C904  4.7u  [0402-CAP]  73.41,14.99 90 bottom
C905  4.7u  [0402-CAP]  72.39,14.99 90 bottom
C906  4.7u  [0402-CAP]  71.37,12.06 0 bottom
C907  4.7u  [0402-CAP]  87.07,64.01 270 bottom
C908  4.7u  [0402-CAP]  96.9,52.63 0 bottom
C909  4.7u  [0402-CAP]  75.82,52.63 180 bottom
C910  4.7u  [0402-CAP]  87.07,42.8 90 bottom
C911  4.7u  [0402-CAP]  83.31,52.07 45 bottom
C912  4.7u  [0402-CAP]  87.63,56.39 45 bottom
C913  4.7u  [0402-CAP]  87.63,50.29 315 bottom
C914  4.7u  [0402-CAP]  85.09,56.39 135 bottom
C915  DNP  [0805-CAP]  86.36,36.07 270 top
C916  0.1u  [0402-CAP]  75.44,14.99 90 bottom
C917  0.1u  [0402-CAP]  74.8,17.53 270 bottom
C918  0.1u  [0402-CAP]  72.9,16.51 180 bottom
C919  0.1u  [0402-CAP]  76.83,19.3 180 bottom
C920  0.1u  [0402-CAP]  76.83,16.51 0 bottom
C921  0.1u  [0402-CAP]  77.6,14.99 90 bottom
C922  0.1u  [0402-CAP]  75.18,12.7 180 bottom
C923  0.1u  [0402-CAP]  71.37,13.08 0 bottom
C924  0.1u  [0402-CAP]  85.65,64.01 270 bottom
C925  0.1u  [0402-CAP]  85.65,58.42 270 bottom
C926  0.1u  [0402-CAP]  87.07,58.42 270 bottom
C927  0.1u  [0402-CAP]  94.11,54.05 180 bottom
C928  0.1u  [0402-CAP]  94.11,52.63 180 bottom
C929  0.1u  [0402-CAP]  96.9,54.05 0 bottom
C930  0.1u  [0402-CAP]  89.92,54.05 180 bottom
C931  0.1u  [0402-CAP]  81.28,54.05 180 bottom
C932  0.1u  [0402-CAP]  81.28,52.63 180 bottom
C933  0.1u  [0402-CAP]  75.82,54.05 180 bottom
C934  0.1u  [0402-CAP]  87.07,48.26 90 bottom
C935  0.1u  [0402-CAP]  85.65,45.59 270 bottom
C936  0.1u  [0402-CAP]  85.65,42.8 90 bottom
C937  0.1u  [0402-CAP]  87.5,54.48 315 bottom
C938  0.1u  [0402-CAP]  85.22,52.2 135 bottom
C939  0.1u  [0402-CAP]  85.22,54.48 225 bottom
C940  0.1u  [0402-CAP]  87.5,52.2 45 bottom
C941  0.1u  [0402-CAP]  89.92,52.63 180 bottom
C942  0.1u  [0402-CAP]  85.09,50.29 225 bottom
D101  D1213A-02SO  [SOT23-6]  162.94,45.47 270 top
D201  D1213A-02SO  [SOT23-6]  118.49,9.14 0 top
D202  D1213A-02SO  [SOT23-6]  162.94,37.47 270 top
D203  [SOD123]  109.09,10.54 270 top
D501  D1213A-02SO  [SOT23-6]  162.69,66.42 90 top
D502  D1213A-02SO  [SOT23-6]  162.69,54.48 90 top
D503  D1213A-02SO  [SOT23-6]  67.44,9.4 270 top
D701  [SOD128]  11.94,15.24 90 top
F701  2920L600/16MR  [2920-FUSE]  19.43,15.24 180 top
FID901  FIDUCIALUFIDUCIAL  [MICRO-FIDUCIAL]  1.4,6.99 0 top
FID902  FIDUCIALUFIDUCIAL  [MICRO-FIDUCIAL]  1.4,86.74 0 top
FID903  FIDUCIALUFIDUCIAL  [MICRO-FIDUCIAL]  171.32,86.74 0 top
FID904  FIDUCIALUFIDUCIAL  [MICRO-FIDUCIAL]  86.36,38.99 0 top
FID905  FIDUCIALUFIDUCIAL  [MICRO-FIDUCIAL]  1.4,7.11 0 bottom
FID906  FIDUCIALUFIDUCIAL  [MICRO-FIDUCIAL]  1.4,86.87 0 bottom
FID907  FIDUCIALUFIDUCIAL  [MICRO-FIDUCIAL]  171.32,86.87 0 bottom
J101  M20X2_PTH  [M20X2_PTH]  140.21,26.54 90 top
J102  M04X1_JST_SH_RA  [M04X1_JST_SH_SM_RA]  171.96,44.45 90 top
J201  M04X1_JST_SH_RA  [M04X1_JST_SH_SM_RA]  120.02,0.76 0 top
J202  M04X1_JST_SH_RA  [M04X1_JST_SH_SM_RA]  171.96,36.58 90 top
J203  USB-MICRO  [USB-MICRO]  74.04,1.91 0 top
J204  M04X2_0.050_SMD_NO_CREAM  [M04X2_0.050_SMD_NO_CREAM]  64.14,21.08 270 top
J205  M04X2_0.050_SMD_NO_CREAM  [M04X2_0.050_SMD_NO_CREAM]  84.45,30.1 270 top
J206  M02POLAR  [MOLEX-1X2]  105.41,10.41 180 top
J301  M04X2_0.050_SMD_NO_CREAM  [M04X2_0.050_SMD_NO_CREAM]  116.08,36.07 0 top
J302  M03X2PTH  [2X3-NS]  107.19,46.1 90 top
J303  M05X2_SMD_0.050_NOCREAM  [M05X2_0.050_SMD_NO_CREAM]  123.44,47.37 0 top
J401  M20X2_HARFLEX_M  [M20X2_HARFLEX_M]  17.78,84.58 180 top
J402  M20X2_HARFLEX_M  [M20X2_HARFLEX_M]  52.07,84.58 180 top
J403  M20X2_HARFLEX_M  [M20X2_HARFLEX_M]  86.36,84.58 180 top
J404  M20X2_HARFLEX_M  [M20X2_HARFLEX_M]  120.65,84.58 180 top
J405  M20X2_HARFLEX_M  [M20X2_HARFLEX_M]  154.94,84.58 180 top
J501  SMAMMCX_PTH  [MMCX_PTH_STR]  169.42,69.09 0 top
J502  SMAMMCX_PTH  [MMCX_PTH_STR]  169.42,63.75 0 top
J503  SMAMMCX_PTH  [MMCX_PTH_STR]  169.42,57.15 0 top
J504  SMAMMCX_PTH  [MMCX_PTH_STR]  169.42,51.82 0 top
J505  SMAMMCX_PTH  [MMCX_PTH_STR]  62.74,3.3 0 top
J601  M13X2_0.050_SHF  [M13X2_0.050_SHF]  99.06,30.48 0 top
J602  M04X2_0.050_SMD_NO_CREAM  [M04X2_0.050_SMD_NO_CREAM]  72.14,47.24 180 top
J701  M03X2PTH  [2X3-NS]  5.21,15.24 0 top
J702  POWERJACK_PJ051AH  [PJ051AH]  16,3.3 90 top
JP201  [MOLEX-1X3]  72.14,29.72 0 top
JP601  TLW-107-05-G-S  [1X07]  145.54,47.75 0 top
LED101  LTST-C191KRKT  [LED-0603]  147.57,2.29 180 top
LED102  LTST-C191KGKT  [LED-0603]  149.35,2.29 180 top
LED201  LTST-C191KRKT  [LED-0603]  96.77,2.29 180 top
LED202  LTST-C191KGKT  [LED-0603]  98.55,2.29 180 top
LED301  LTST-C191KRKT  [LED-0603]  127.51,2.29 180 top
LED302  LTST-C191KGKT  [LED-0603]  129.29,2.29 180 top
LED303  LTST-C191KRKT  [LED-0603]  131.06,2.29 180 top
LED304  LTST-C191KGKT  [LED-0603]  132.84,2.29 180 top
LED601  LTST-C191KRKT  [LED-0603]  56.39,2.29 0 top
LED602  LTST-C191KGKT  [LED-0603]  58.17,2.29 0 top
LED603  LTST-C191KGKT  [LED-0603]  131.95,47.75 90 top
LF501  FERRITE1206  [1206]  146.3,58.29 270 top
LF601  FERRITE1206  [1206]  147.57,43.94 0 top
LF701  FERRITE1206  [1206]  16.13,67.56 0 top
LS601  PKMCS0909E4000-R1  [XDCR_PKMCS0909E4000-R1]  140.08,6.35 270 top
Q201  MOSFET-NCHANNELSMD  [SOT23-3]  98.81,10.16 90 top
R101  10k  [0402-RES]  160.27,45.47 90 top
R102  10k  [0402-RES]  159.13,45.47 270 top
R103  10k  [0402-RES]  141.22,17.91 0 top
R104  470  [0402-RES]  147.57,5.33 90 top
R105  470  [0402-RES]  149.35,5.33 90 top
R201  1k  [0402-RES]  84.2,6.99 180 top
R202  DNP  [0402-RES]  81.66,6.99 180 top
R203  10k  [0402-RES]  85.47,20.7 90 top
R204  10k  [0402-RES]  84.45,20.7 90 top
R205  100k  [0402-RES]  70.48,22.1 180 top
R206  47k  [0402-RES]  62.99,12.7 180 top
R207  10k  [0402-RES]  83.31,20.7 90 top
R208  10k  [0402-RES]  82.3,20.7 90 top
R209  27  [0402-RES]  74.3,10.54 270 top
R210  10k  [0402-RES]  62.99,11.3 0 top
R211  27  [0402-RES]  73.28,10.54 270 top
R212  DNP  [0402-RES]  79.38,35.43 180 top
R213  1k  [0402-RES]  73.53,22.86 90 top
R214  DNP  [0402-RES]  79.38,34.16 180 top
R215  470  [0402-RES]  96.77,5.33 90 top
R216  470  [0402-RES]  98.55,5.33 90 top
R217  100k  [0402-RES]  98.81,7.62 180 top
R218  10k  [0402-RES]  88.52,6.99 0 top
R301  10k  [0402-RES]  116.08,43.94 0 top
R302  10k  [0402-RES]  116.08,40.51 0 top
R303  DNP  [0402-RES]  116.08,42.8 0 top
R304  DNP  [0402-RES]  116.08,41.66 0 top
R305  10k  [0402-RES]  100.33,48.77 270 top
R306  10k  [0402-RES]  99.31,48.77 90 top
R307  10k  [0402-RES]  100.33,46.23 90 top
R308  470  [0402-RES]  127.51,5.33 90 top
R309  470  [0402-RES]  129.29,5.33 90 top
R310  470  [0402-RES]  131.06,5.33 90 top
R311  470  [0402-RES]  132.84,5.33 90 top
R312  10k  [0402-RES]  99.31,46.23 90 top
R501  1k  [0402-RES]  164.97,69.09 90 top
R502  27  [0402-RES]  157.61,70.48 180 top
R503  DNP  [0805]  165.86,69.09 270 bottom
R504  10k  [0402-RES]  166.12,69.09 270 top
R505  1k  [0402-RES]  164.97,63.75 90 top
R506  27  [0402-RES]  157.61,61.85 180 top
R507  DNP  [0805]  165.86,63.75 270 bottom
R508  10k  [0402-RES]  166.12,63.75 270 top
R509  100  [0402-RES]  164.97,57.15 90 top
R510  DNP  [0805]  165.86,57.15 270 bottom
R511  10k  [0402-RES]  166.12,57.15 270 top
R512  100  [0402-RES]  164.97,51.44 90 top
R513  DNP  [0805]  165.86,51.82 270 bottom
R514  10k  [0402-RES]  166.12,51.44 270 top
R515  100  [0402-RES]  62.74,7.75 0 top
R516  DNP  [0805]  62.74,6.86 180 bottom
R517  10k  [0402-RES]  62.74,6.6 0 top
R601  1k  [0402-RES]  82.3,16.89 180 top
R602  1k  [0402-RES]  123.7,22.61 90 top
R603  470  [0402-RES]  56.39,5.33 270 top
R604  470  [0402-RES]  58.17,5.33 270 top
R605  470  [0402-RES]  134.87,47.75 180 top
R606  1k  [0402-RES]  134.87,49.15 0 top
R607  1k  [0402-RES]  134.87,50.16 0 top
R608  1k  [0402-RES]  134.87,51.18 0 top
R609  1k  [0402-RES]  134.87,52.32 0 top
R701  1k  [0402-RES]  29.21,77.47 90 top
R702  47k  [0402-RES]  27.18,77.47 90 top
R703  100k  [0402-RES]  26.04,73.03 270 top
R704  8.66k  [0402-RES]  26.16,77.47 90 top
R705  1k  [0402-RES]  68.58,78.23 90 top
R706  47k  [0402-RES]  66.55,78.23 90 top
R707  100k  [0402-RES]  65.15,74.04 270 top
R708  8.66k  [0402-RES]  65.53,78.23 90 top
R709  1k  [0402-RES]  130.56,76.96 90 top
R710  47k  [0402-RES]  128.52,76.96 90 top
R711  100k  [0402-RES]  127.25,72.64 270 top
R712  8.66k  [0402-RES]  127.51,76.96 90 top
R713  1k  [0402-RES]  160.53,17.78 90 top
R714  47k  [0402-RES]  158.5,17.78 90 top
R715  100k  [0402-RES]  157.1,13.46 270 top
R716  8.66k  [0402-RES]  157.48,17.78 90 top
R717  1k  [0402-RES]  62.74,39.12 0 top
R718  47k  [0402-RES]  62.74,41.15 0 top
R719  15k  [0402-RES]  62.74,42.16 0 top
R801  82  [0402-RES]  41.91,52.83 0 top
R802  180k  [0402-RES]  38.23,54.1 0 top
R803  220k  [0402-RES]  39.37,37.59 180 top
R804  100k  [0402-RES]  41.91,54.1 0 top
R805  82  [0402-RES]  42.93,38.86 0 top
R806  180k  [0402-RES]  38.61,40.13 0 top
R807  15  [0402-RES]  17.14,52.32 90 top
R808  68k  [0402-RES]  16,52.32 90 top
R901  68k  [0402-RES]  40.89,69.98 180 top
R902  100k  [0402-RES]  38.23,71.25 0 top
R903  DNP  [0402-RES]  38.23,69.98 0 top
R904  6.8k  [0402-RES]  43.05,69.98 180 top
R905  100  [0402-RES]  72.14,10.54 90 top
S101  SWITCH-MOMENTARY-2SMD-3  [TACTILE_SWITCH_SMD-3]  93.34,3.43 90 top
S201  SWITCH-MOMENTARY-2SMD-3  [TACTILE_SWITCH_SMD-3]  83.69,3.43 90 top
S202  SWITCH-MOMENTARY-2SMD-3  [TACTILE_SWITCH_SMD-3]  88.52,3.43 270 top
TP201  TESTPOINT_ROUND  [TESTPAD_ROUND]  70.99,23.75 0 top
TP202  TESTPOINT_ROUND  [TESTPAD_ROUND]  68.07,5.33 0 top
TP301  TESTPOINT_ROUND  [TESTPAD_ROUND]  93.98,62.61 0 top
TP501  TESTPOINT_ROUND  [TESTPAD_ROUND]  153.03,54.48 0 top
TP502  TESTPOINT_ROUND  [TESTPAD_ROUND]  155.96,54.48 0 top
TP701  TESTPOINT_ROUND  [TESTPAD_ROUND]  32.51,78.61 0 top
TP702  TESTPOINT_ROUND  [TESTPAD_ROUND]  97.54,75.31 180 top
TP703  TESTPOINT_ROUND  [TESTPAD_ROUND]  136.02,78.61 180 top
TP704  TESTPOINT_ROUND  [TESTPAD_ROUND]  13.34,39.88 0 top
TP705  TESTPOINT_ROUND  [TESTPAD_ROUND]  162.94,30.73 0 top
TP706  TESTPOINT_ROUND  [TESTPAD_ROUND]  65.41,35.31 90 top
TP801  TESTPOINT_ROUND  [TESTPAD_ROUND]  55.63,51.18 270 top
TP802  TESTPOINT_ROUND  [TESTPAD_ROUND]  45.47,66.8 270 top
TP803  TESTPOINT_ROUND  [TESTPAD_ROUND]  43.69,66.8 270 top
TP804  TESTPOINT_ROUND  [TESTPAD_ROUND]  60.83,55.63 0 top
TP805  TESTPOINT_ROUND  [TESTPAD_ROUND]  60.83,50.42 0 top
TP806  TESTPOINT_ROUND  [TESTPAD_ROUND]  41.78,45.85 90 bottom
TP807  TESTPOINT_ROUND  [TESTPAD_ROUND]  5.84,60.71 180 top
TP808  TESTPOINT_ROUND  [TESTPAD_ROUND]  3.05,56.39 180 top
TP809  TESTPOINT_ROUND  [TESTPAD_ROUND]  3.05,54.61 180 top
TP810  TESTPOINT_ROUND  [TESTPAD_ROUND]  10.03,52.7 180 bottom
TP901  TESTPOINT_ROUND  [TESTPAD_ROUND]  46.23,76.45 0 top
TP902  TESTPOINT_ROUND  [TESTPAD_ROUND]  75.82,10.41 0 top
TP903  TESTPOINTTUR  [TURRET]  120.14,66.55 0 top
U201  RP2040  [QFN-56_EP]  75.18,16.26 180 top
U202  W25Q_SO  [SO08-208MIL]  86.11,11.18 0 top
U301  MACHXO2_FTBGA256  [LBGA-256]  86.36,53.34 225 top
U501  ADS7886  [SOT363]  154.56,70.36 0 top
U502  LT1801  [SOP65P490X110-8N]  158.88,66.42 90 top
U503  ADS7886  [SOT363]  154.56,64.26 0 top
U504  REF30XX  [SOT23-3]  152.4,58.42 90 top
U505  ADP7182_WSON  [WSON6]  159.26,58.67 270 top
U601  APS6404L  [USON8L-2X3MM]  66.29,47.88 90 top
U602  APS6404L  [USON8L-2X3MM]  68.33,41.27 90 top
U701  RPL-30  [RPL-30]  28.7,73.91 90 top
U702  RPL-30  [RPL-30]  68.07,74.68 90 top
U703  RPL-30  [RPL-30]  130.05,73.41 90 top
U704  RPL-30  [RPL-30]  160.02,14.22 90 top
U705  RPL-30  [RPL-30]  59.31,39.75 0 top
U801  LTM4651  [BGA-77]  39.88,60.45 90 top
U802  LTM4651  [BGA-77]  39.88,46.48 90 top
U803  LTM4651  [BGA-77]  9.4,50.8 180 top
U901  MPM3620_FULL_CREAM  [QFN-20-MPS_FULL_CREAM]  43.05,73.03 90 top
X201  CRYSTAL-3.2-2.5  [CRYSTAL-3.2-2.5]  75.82,24.13 270 top
XO301  OSCILLATOR_TXO2520  [TXO2520]  95.38,46.48 135 top

## Tracks (layer width: path | path; a pad name or v marks a point on that pad's centre or on a via)
ADS_CSN0  (via drill 0.25)
  Top 0.127: U301.H5 v89.9,55.46
  Top 0.203: U501.6 153.91,71.99 v154.18,72.26
  Bottom 0.127: v89.9,55.46 90.64,55.46 92.33,57.15
  Bottom 0.203: 92.33,57.15 135.38,57.15 149.99,71.75 153.67,71.75 v154.18,72.26
ADS_CSN1
  Top 0.127: U301.C1 95.55,54.78 96.27,55.5
  Top 0.203: 96.27,55.5 105.28,55.5 105.79,54.99 136.91,54.99 146.69,64.77 153.67,64.77 153.91,65.01 U503.6
ADS_SCK0  (via drill 0.25)
  Top 0.127: U301.F5 v91.31,54.05
  Top 0.203: v155.7,72.26 155.45,72.01 155.45,71.88 155.19,71.63 155.19,71.37 U501.4
  Bottom 0.127: v91.31,54.05 92.02,54.05 94.11,56.13
  Bottom 0.203: 94.11,56.13 136.14,56.13 151,70.99 154.43,70.99 v155.7,72.26
ADS_SCK1
  Top 0.127: U301.B1 96.26,54.09 96.65,54.48
  Top 0.203: 96.65,54.48 105.03,54.48 105.54,53.98 137.67,53.98 147.7,64.01 154.69,64.01 155.21,64.53 U503.4
ADS_SDO0  (via drill 0.25)
  Top 0.127: U301.G5 v90.6,54.75
  Top 0.203: U501.5 154.56,71.88 v154.94,72.26
  Bottom 0.127: v90.6,54.75 91.33,54.75 93.22,56.64
  Bottom 0.203: 93.22,56.64 135.76,56.64 150.5,71.37 154.05,71.37 v154.94,72.26
ADS_SDO1
  Top 0.127: U301.C2 95.58,54.05 96.52,54.99
  Top 0.203: 96.52,54.99 105.16,54.99 105.66,54.48 137.29,54.48 147.19,64.39 154.43,64.39 154.56,64.52 U503.5
AUXIO0
  Top 0.127: U301.B3 95.58,52.63 96.01,52.2 104.27,52.2
  Top 0.203: 104.27,52.2 105.54,53.47 157.86,53.47 161.29,56.9 163.58,56.9 | R509.2 164.33,57.65 163.58,56.9 | D502.4 163.64,56.84 163.58,56.9
AUXIO1
  Top 0.127: U301.A3 95.65,51.93 95.76,51.82 104.52,51.82
  Top 0.203: 104.52,51.82 105.66,52.96 158.62,52.96 159.65,51.94 163.7,51.94 | R512.2 163.7,51.94 | D502.3 163.64,52 163.7,51.94
BOOTSEL
  Top 0.203: S201.4 84.49,6.26 84.71,6.48 84.71,6.98 R201.1
DETB_END_CYC0
  Top 0.127: U301.R7 82.82,59.67 81.79,60.71 81.79,65.91
  Top 0.203: J402.B15 57.78,80.64 58.42,80.01 58.42,74.42 64.52,68.33 79.38,68.33 81.79,65.91
DETB_END_CYC1
  Top 0.127: U301.P1 87.77,62.63 87.88,62.74 87.88,69.72
  Top 0.203: J403.B15 92.08,80.64 88.9,77.47 88.9,70.74 87.88,69.72
DETB_END_CYC2
  Top 0.127: U301.J1 91.31,59.05 91.69,59.44 91.69,64.26
  Top 0.203: J404.B15 126.36,80.64 126.11,80.39 125.6,80.39 110.87,65.66 93.09,65.66 91.69,64.26
DETB_END_CYC3
  Top 0.127: U301.D1 94.84,55.48 95.25,55.88 95.25,56.13 95.63,56.52
  Top 0.203: J405.B15 160.66,80.64 159.89,79.88 159.13,79.88 135.76,56.52 95.63,56.52
DETB_RUN0
  Top 0.127: J402.A16 59.05,82.55 59.69,81.92 59.69,80.39 | 83.31,65.66 83.31,61.34 U301.T5
  Top 0.203: 59.69,80.39 59.69,74.93 65.28,69.34 79.63,69.34 83.31,65.66
DETB_RUN1  (via drill 0.25)
  Top 0.127: J403.A16 93.34,82.55 93.98,81.92 93.98,80.39 | U301.N3 v87.07,61.12
  Top 0.203: 93.98,80.39 93.98,80.01 90.17,76.2 v90.17,70.48
  Route14 0.127: v90.17,70.48 87.07,67.38 v87.07,61.12
DETB_RUN2  (via drill 0.25)
  Top 0.127: J404.A16 127.64,82.55 128.27,81.92 128.27,80.52 | U301.K5 v88.48,56.88
  Top 0.203: 128.27,80.52 127.13,79.38 126.36,79.38 111.63,64.64 v93.6,64.64
  Route14 0.127: v88.48,56.88 89.13,56.88 89.66,57.4 89.66,58.17 90.17,58.67 90.17,63.5 91.31,64.64 v93.6,64.64
DETB_RUN3  (via drill 0.25)
  Top 0.127: U301.E3 v93.43,54.75 | J405.A16 161.93,82.55 162.56,81.92 162.56,80.52
  Top 0.203: 162.56,80.52 162.56,80.26 161.16,78.87 159.89,78.87 136.53,55.5 v106.17,55.5
  Route14 0.127: v93.43,54.75 93.49,54.75 94.74,56.01 105.66,56.01 v106.17,55.5
DETB_SELECT00
  Top 0.127: U301.R9 81.41,58.29 80.26,59.44 80.26,64.9
  Top 0.203: J402.B11 52.7,80.14 56.13,76.71 56.13,73.15 62.99,66.29 78.87,66.29 80.26,64.9
DETB_SELECT01
  Top 0.127: U301.R11 80,56.91 78.74,58.17 78.74,63.88
  Top 0.203: J402.B9 50.16,79.12 54.1,75.18 54.1,71.63 61.47,64.26 78.36,64.26 78.74,63.88
DETB_SELECT02
  Top 0.127: J402.A10 51.44,82.55 52.07,81.92 52.07,80.39 | U301.T9 79.88,59.11 79.88,64.64
  Top 0.203: 52.07,80.39 52.07,79.88 55.63,76.33 55.63,72.77 62.61,65.79 78.74,65.79 79.88,64.64
DETB_SELECT03  (via drill 0.25)
  Top 0.127: U301.N9 v82.82,56.88
  Top 0.203: J402.B7 47.62,79.88 53.09,74.42 53.09,70.87 60.71,63.25 v77.72,63.25
  Route14 0.127: v82.82,56.88 82.82,57.64 81.92,58.55 81.92,59.05 v77.72,63.25
DETB_SELECT04  (via drill 0.25)
  Top 0.127: U301.N11 v81.41,55.46
  Top 0.203: J402.B5 45.09,78.87 51.05,72.9 51.05,69.34 59.18,61.21 v76.2,61.21
  Route14 0.127: v81.41,55.46 81.41,56.13 76.58,60.96 76.45,60.96 v76.2,61.21
DETB_SELECT05  (via drill 0.25)
  Top 0.127: U301.P9 v82.12,57.58 | J402.A6 46.35,82.55 46.99,81.92 46.99,80.39
  Top 0.203: 46.99,80.39 46.99,79.63 52.58,74.04 52.58,70.48 60.33,62.74 v77.34,62.74
  Route14 0.127: v82.12,57.58 | v82.12,57.58 81.53,58.17 81.53,58.55 v77.34,62.74
DETB_SELECT06
  Top 0.127: U301.T2 85.65,69.78
  Top 0.203: J403.B11 87,71.12 85.65,69.78
DETB_SELECT07
  Top 0.127: U301.T4 84.24,62.06 84.07,62.23 84.07,70.74
  Top 0.203: J403.B9 84.45,71.12 84.07,70.74
DETB_SELECT08
  Top 0.127: 85.09,80.39 85.09,81.92 85.72,82.55 J403.A10 | U301.R4 84.95,61.87 84.45,62.36 84.45,70.48
  Top 0.203: 85.09,80.39 85.09,71.12 84.45,70.48
DETB_SELECT09  (via drill 0.25)
  Top 0.127: U301.P5 v84.95,60.41
  Top 0.203: J403.B7 81.92,80.01 82.55,79.38 v82.55,71.12
  Route14 0.127: v82.55,71.12 84.95,68.72 v84.95,60.41
DETB_SELECT10  (via drill 0.25)
  Top 0.127: U301.N8 v83.53,57.58
  Top 0.203: J403.B5 79.38,79.5 80.01,78.87 v80.01,70.61
  Route14 0.127: v83.53,57.58 83.53,58.33 82.93,58.93 82.93,67.69 v80.01,70.61
DETB_SELECT11  (via drill 0.25)
  Top 0.127: J403.A6 80.64,82.55 81.28,81.92 81.28,80.39 | U301.N6 v84.95,59
  Top 0.203: 81.28,80.39 81.28,79.88 81.92,79.25 v81.92,70.99
  Route14 0.127: v81.92,70.99 84.45,68.45 84.45,60.2 84.95,59.71 v84.95,59
DETB_SELECT12
  Top 0.127: U301.K2 89.9,59.8 90.55,60.45 90.55,65.41
  Top 0.203: J404.B11 121.28,78.74 109.73,67.18 92.33,67.18 90.55,65.41
DETB_SELECT13
  Top 0.127: U301.M2 88.48,61.18 89.03,61.72 89.03,66.93
  Top 0.203: J404.B9 118.75,79.76 108.2,69.22 91.31,69.22 89.03,66.93
DETB_SELECT14
  Top 0.127: J404.A10 120.02,82.55 119.38,81.92 119.38,80.52 | U301.M1 89.41,61.34 89.41,66.55
  Top 0.203: 119.38,80.52 119.38,79.5 108.58,68.71 91.57,68.71 89.41,66.55
DETB_SELECT15  (via drill 0.25)
  Top 0.127: U301.J4 v89.19,57.58
  Top 0.203: J404.B7 116.2,78.99 107.44,70.23 v94.49,70.23
  Route14 0.127: v89.19,57.58 89.19,58.33 89.79,58.93 89.79,65.53 v94.49,70.23
DETB_SELECT16  (via drill 0.25)
  Top 0.127: U301.L4 v87.77,59
  Top 0.203: J404.B5 113.67,80.01 105.92,72.26 93.47,72.26 v91.95,70.74
  Route14 0.127: v87.77,59 87.77,59.71 88.27,60.2 88.27,67.06 v91.95,70.74
DETB_SELECT17  (via drill 0.25)
  Top 0.127: J404.A6 114.94,82.55 114.3,81.92 114.3,80.52 | U301.L3 v88.48,59.7
  Top 0.203: 114.3,80.52 114.3,79.76 106.3,71.75 93.73,71.75 v92.58,70.61
  Route14 0.127: v88.48,59.7 88.48,59.78 88.65,59.94 88.65,66.67 v92.58,70.61
DETB_SELECT18
  Top 0.127: U301.F2 93.38,56.17 95.25,58.04
  Top 0.203: J405.B11 155.57,78.99 134.62,58.04 95.25,58.04
DETB_SELECT19
  Top 0.127: U301.H2 92,57.58 94.49,60.07
  Top 0.203: J405.B9 153.03,80.01 133.1,60.07 94.49,60.07
DETB_SELECT20
  Top 0.127: J405.A10 154.31,82.55 153.67,81.92 153.67,80.52 | U301.G1 92.72,57.67 94.61,59.56
  Top 0.203: 153.67,80.52 153.67,79.76 133.48,59.56 94.61,59.56
DETB_SELECT21  (via drill 0.25)
  Top 0.127: U301.F4 v92.02,54.75
  Top 0.203: J405.B7 150.5,79.25 132.33,61.09 v99.06,61.09
  Route14 0.127: v92.02,54.75 92.73,54.75 v99.06,61.09
DETB_SELECT22  (via drill 0.25)
  Top 0.127: U301.H4 v90.6,56.17
  Top 0.203: J405.B5 147.96,80.26 130.81,63.12 98.04,63.12 v96.52,61.59
  Route14 0.127: v90.6,56.17 91.35,56.17 92.08,56.9 92.08,57.15 v96.52,61.59
DETB_SELECT23  (via drill 0.25)
  Top 0.127: J405.A6 149.22,82.55 148.59,81.92 148.59,80.52 | U301.G3 v92.02,56.17
  Top 0.203: 148.59,80.52 148.59,80.01 131.19,62.61 98.3,62.61 v97.16,61.47
  Route14 0.127: v92.02,56.17 92.02,56.33 v97.16,61.47
DETB_STATUS_SELECT0
  Top 0.127: U301.R6 83.53,60.36 82.93,60.96 82.93,65.41
  Top 0.203: J402.B16 59.05,74.68 64.9,68.83 79.5,68.83 82.93,65.41
DETB_STATUS_SELECT1
  Top 0.127: U301.N2 87.77,61.87 88.27,62.36 88.27,69.34
  Top 0.203: J403.B16 93.34,80.64 89.53,76.83 89.53,70.61 88.27,69.34
DETB_STATUS_SELECT2
  Top 0.127: U301.J2 91.31,58.29 92.08,59.05 92.08,63.88
  Top 0.203: J404.B16 127.64,80.64 126.87,79.88 125.98,79.88 111.25,65.15 93.34,65.15 92.08,63.88
DETB_STATUS_SELECT3
  Top 0.127: U301.D2 94.89,54.75 95.63,55.5 95.63,55.88 95.76,56.01
  Top 0.203: J405.B16 161.93,80.64 160.66,79.38 159.51,79.38 136.14,56.01 95.76,56.01
DETB_TRIGGER0
  Top 0.127: U301.T7 82.12,59.74 81.41,60.45 81.41,65.66
  Top 0.203: J402.B14 56.52,80.64 57.78,79.38 57.78,74.17 64.14,67.82 79.25,67.82 81.41,65.66
DETB_TRIGGER1
  Top 0.127: U301.P2 87.07,62.56 87.5,62.99 87.5,70.1
  Top 0.203: J403.B14 90.81,80.64 88.27,78.11 88.27,70.87 87.5,70.1
DETB_TRIGGER2
  Top 0.127: U301.J3 89.9,58.27 91.31,59.69 91.31,64.64
  Top 0.203: J404.B14 125.09,80.77 110.49,66.17 92.84,66.17 91.31,64.64
DETB_TRIGGER3
  Top 0.127: U301.E2 94.2,55.46 94.74,56.01 94.74,56.26 95.5,57.02
  Top 0.203: J405.B14 159.38,80.64 159.13,80.39 158.75,80.39 135.38,57.02 95.5,57.02
EXP_J303_D0  (via drill 0.25)
  Top 0.127: U301.C5 v93.43,51.93
  Top 0.203: v123.7,49.91 J303.2
  Route14 0.127: v93.43,51.93 93.43,51.86 93.6,51.69 105.28,51.69
  Route14 0.203: 105.28,51.69 121.92,51.69 v123.7,49.91
EXP_J303_D1  (via drill 0.25)
  Top 0.127: U301.D6 v92.02,51.93
  Top 0.203: v123.7,48.64 J303.4
  Route14 0.127: v92.02,51.93 92.47,51.93 93.09,51.31 105.28,51.31
  Route14 0.203: 105.28,51.31 121.03,51.31 v123.7,48.64
EXP_J303_D2  (via drill 0.25)
  Top 0.127: U301.D7 v91.31,51.22
  Top 0.203: v123.7,47.37 J303.6
  Route14 0.127: v91.31,51.22 92.16,51.22 92.46,50.93 105.28,50.93
  Route14 0.203: 105.28,50.93 120.14,50.93 v123.7,47.37
EXP_J303_D3  (via drill 0.25)
  Top 0.127: U301.C7 v92.02,50.51
  Top 0.203: v123.7,46.1 J303.8
  Route14 0.127: v92.02,50.51 92.42,50.51 92.46,50.55 105.28,50.55
  Route14 0.203: 105.28,50.55 119.76,50.55 120.4,49.91 120.4,49.4 v123.7,46.1
EXP_J601_D0  (via drill 0.25)
  Top 0.127: U301.C10 v89.19,47.68
  Top 0.203: v95.12,36.83 J601.3
  Route14 0.127: v89.19,47.68 89.22,47.68 91.31,45.59 91.31,44.96 91.69,44.58 v92.33,44.58
  Bottom 0.203: v92.33,44.58 92.33,39.62 v95.12,36.83
EXP_J601_D1  (via drill 0.25)
  Top 0.127: U301.B10 89.9,47.01 v91.82,45.09
  Top 0.203: v95.12,35.56 J601.5
  Bottom 0.203: v91.82,45.09 91.82,38.86 v95.12,35.56
EXP_J601_D2
  Top 0.127: U301.A13 88.5,44.85 91.95,41.4
  Top 0.203: 91.95,41.4 93.98,39.37 93.98,35.43 95.12,34.29 J601.7
EXP_J601_D3  (via drill 0.25)
  Top 0.127: U301.E10 v87.77,49.1
  Top 0.203: v95.12,33.02 J601.9
  Bottom 0.127: v87.77,49.1 87.77,48.37 91.31,44.83
  Bottom 0.203: 91.31,44.83 91.31,36.83 v95.12,33.02
EXP_J601_D4  (via drill 0.25)
  Top 0.127: U301.D11 v87.77,47.68
  Top 0.203: v95.12,31.75 J601.11
  Route14 0.127: v87.77,47.68 87.77,46.97 90.17,44.58 90.17,44.45 92.58,42.04
  Route14 0.203: 92.58,42.04 92.58,34.29 v95.12,31.75
EXP_J601_D5  (via drill 0.25)
  Top 0.127: U301.C12 v87.77,46.27
  Top 0.203: v95.12,30.48 J601.13
  Route14 0.127: v87.77,46.27 87.84,46.27 92.08,42.04
  Route14 0.203: 92.08,42.04 92.08,33.53 v95.12,30.48
EXP_J601_D6  (via drill 0.25)
  Top 0.127: U301.C13 v87.07,45.56
  Top 0.203: v95.12,29.21 J601.15
  Route14 0.127: v87.07,45.56 87.79,45.56 91.57,41.78
  Route14 0.203: 91.57,41.78 91.57,32.77 v95.12,29.21
FP_LED0  (via drill 0.25)
  Top 0.127: U301.A15 87.11,43.44 87.63,42.93 87.88,42.93 90.42,40.39
  Top 0.203: 90.42,40.39 91.95,38.86 91.95,20.7 93.09,19.56 99.31,19.56 102.11,16.76 122.43,16.76 123.44,15.75 v127.51,15.75 | v127.51,6.86 R308.2
  Bottom 0.203: v127.51,15.75 v127.51,6.86
FP_LED1  (via drill 0.25)
  Top 0.127: U301.B14 87.07,44.12 87.88,43.31 88.14,43.31 90.81,40.64
  Top 0.203: 90.81,40.64 92.46,38.99 92.46,20.83 93.34,19.94 99.57,19.94 102.36,17.14 122.68,17.14 123.57,16.26 128.78,16.26 v129.29,15.75 | v129.29,6.86 R309.2
  Bottom 0.203: v129.29,15.75 v129.29,6.86
FP_LED2  (via drill 0.25)
  Top 0.127: 91.19,40.89 88.19,43.89 88.03,43.89 U301.A14
  Top 0.203: 91.19,40.89 92.96,39.12 92.96,20.95 93.6,20.32 99.82,20.32 102.62,17.53 122.94,17.53 123.83,16.64 130.18,16.64 v131.06,15.75 | v131.06,6.86 R310.2
  Bottom 0.203: v131.06,15.75 v131.06,6.86
FP_LED3  (via drill 0.25)
  Top 0.127: U301.B13 87.77,44.94 91.57,41.15
  Top 0.203: 91.57,41.15 93.47,39.24 93.47,21.08 93.85,20.7 100.08,20.7 102.87,17.91 123.19,17.91 124.08,17.02 131.57,17.02 v132.84,15.75 | v132.84,6.86 R311.2
  Bottom 0.203: v132.84,15.75 v132.84,6.86
FP_SCL
  Top 0.127: U301.A9 91.38,47.68 94.87,44.2 96.52,44.2
  Top 0.203: 96.52,44.2 102.87,44.2 105.03,42.04 114.17,42.04 114.94,42.8 R303.1 R301.1
FP_SDA
  Top 0.127: U301.C9 89.9,48.41 94.49,43.81 96.27,43.81
  Top 0.203: 96.27,43.81 102.62,43.81 104.78,41.66 R304.1 R302.1
FT_C0
  Top 0.127: U301.G16 81.03,45.88 81.03,45.09
  Top 0.203: A601.CN2-18 51.31,24.89 53.59,24.89 60.45,31.75 66.55,31.75 79.63,44.83 80.77,44.83 81.03,45.09
FT_C1
  Top 0.127: U301.G15 82.82,47.01 81.41,45.59 81.41,44.83
  Top 0.203: A601.CN2-17 52.96,23.62 60.71,31.37 66.8,31.37 79.88,44.45 81.03,44.45 81.41,44.83
FT_C2  (via drill 0.25)
  Top 0.127: U301.H13 v83.53,49.1
  Route14 0.127: v83.53,49.1 83.53,48.35 82.8,47.62 82.04,47.62 80.26,45.85
  Route14 0.203: A601.CN2-20 51.31,27.43 53.59,27.43 58.17,32 66.42,32 80.26,45.85
FT_C5
  Top 0.127: U301.H16 80.08,46.35 79.88,46.35
  Top 0.203: 79.88,46.35 66.04,32.51 51.31,32.51 A601.CN2-24
FT_C6
  Top 0.127: U301.H15 82.12,47.7 80.39,45.97 80.14,45.97
  Top 0.203: A601.CN2-23 53.47,32.13 66.29,32.13 80.14,45.97
FT_CTS#
  Top 0.127: U201.39 69.34,14.86
  Top 0.203: 69.34,14.86 63.25,14.86 54.61,6.22 54.61,2.41 54.23,2.03 49.4,2.03 34.42,17.02 34.42,26.54 A601.CN3-23
FT_D4  (via drill 0.25)
  Top 0.127: U301.G12 v84.95,49.1
  Top 0.203: A601.CN2-14 51.31,19.81 53.59,19.81 64.77,30.99 67.06,30.99 80.14,44.07 v81.41,44.07
  Bottom 0.127: v84.95,49.1 84.95,48.37 81.41,44.83 v81.41,44.07
FT_D5
  Top 0.127: U301.F16 82.82,46.25 81.92,45.34 81.92,43.81
  Top 0.203: A601.CN2-13 52.96,18.54 65.02,30.61 67.31,30.61 80.26,43.56 81.66,43.56 81.92,43.81
FT_D6  (via drill 0.25)
  Top 0.127: U301.G14 v83.53,47.68
  Route14 0.127: v83.53,47.68 80.68,44.83 80.64,44.83
  Route14 0.203: A601.CN2-16 51.31,22.35 53.59,22.35 62.48,31.24 66.93,31.24 80.52,44.83 80.64,44.83
FT_D7  (via drill 0.25)
  Top 0.127: U301.G13 v84.24,48.39
  Route14 0.127: v84.24,48.39 84.24,47.66 81.03,44.45
  Route14 0.203: A601.CN2-15 53.09,21.08 62.87,30.86 67.18,30.86 80.77,44.45 81.03,44.45
FT_RTS#  (via drill 0.25)
  Top 0.127: U201.38 69.36,15.26 69.34,15.24
  Top 0.203: 69.34,15.24 62.99,15.24 54.23,6.48 54.23,5.33 53.47,4.57 47.5,4.57 34.8,17.27 34.8,27.18 v32,29.97
  Bottom 0.203: v32,29.97 28.45,29.97 A601.CN3-24
FT_RXD
  Top 0.127: U201.36 69.4,16.06 69.34,16
  Top 0.203: 69.34,16 62.48,16 56.13,9.65 43.69,9.65 35.56,17.78 35.56,28.07 30.23,33.4 30.1,33.4 A601.CN3-25
FT_TXD
  Top 0.127: U201.37 69.38,15.66 69.34,15.62
  Top 0.203: 69.34,15.62 62.74,15.62 54.23,7.11 45.59,7.11 35.18,17.53 35.18,27.81 30.48,32.51 28.45,32.51 A601.CN3-26
GND  (via drill 0.25)
  Top 0.127: U301.J9 v84.95,53.34 | U301.H8 v87.77,53.34 | v87.77,53.34 | U301.H9 v86.36,51.93 | v86.36,51.93 | U301.J8 v86.36,54.75 | U301.L6 v86.36,57.58 | U301.M5 v86.36,59 | U301.L11 v82.12,53.34 | U301.M12 v80.7,53.34 | U301.N13 v79.29,53.34 | U301.P14 v77.88,53.34 | U301.R15 v76.46,53.34 | U301.F11 v86.36,49.1 | v86.36,49.1 | U301.E12 v86.36,47.68 | v86.36,47.68 | U301.D13 v86.36,46.27 | v86.36,46.27 | U301.C14 v86.36,44.85 | v86.36,44.85 | U301.B15 v86.36,43.44 | v86.36,43.44 | U301.B2 v96.26,53.34 | v96.26,53.34 | U301.C3 v94.84,53.34 | v94.84,53.34 | U301.D4 v93.43,53.34 | v93.43,53.34 | U301.E5 v92.02,53.34 | v92.02,53.34 | U301.F6 v90.6,53.34 | v90.6,53.34 | U301.N4 v86.36,60.41 | U301.R2 v86.36,63.24 | U301.P3 v86.36,61.83 | U201.19 76.18,20.94 76.33,21.08 v76.33,21.46 | U601.4 v67.69,46.48 | U602.4 69.08,40.63 v69.09,40.64
  Top 0.203: U803.D4 v10.03,47.62 | U803.H1 v13.84,53.98 | U803.G1 v13.84,52.7 | LED603.C 131.19,47.76 v131.19,48.77 | v67.44,9.65 D503.2 | C204.2 v61.72,10.03 | R210.1 v61.72,11.3 | R218.1 v87.25,6.99 | v80.77,9.27 U202.4 v83.69,9.27 | S201.1 82.93,1.42 v82.93,2.41 | v100.71,9.14 99.77,9.14 Q201.2 99.76,8.07 R217.1 | D201.2 v118.24,9.14 | J201.1 118.36,5.69 v118.36,6.73 | S101.1 91.46,1.38 v91.44,1.4 | LED201.C 97.65,1.54 v97.66,1.52 97.67,1.54 LED202.C | LED102.C 149.34,1.52 v148.46,1.52 147.59,1.52 LED101.C | R805.2 v44.2,38.86 | U802.G1 v41.78,42.04 | U802.H1 v43.05,42.04 | U801.G1 v41.78,56.01 | U801.H1 v43.05,56.01 | v43.18,54.1 R804.2 | R801.2 v43.18,52.83 | U801.D4 v36.7,59.82 | J203.5 75.34,5.68 v75.31,5.71 | U802.D4 v36.7,45.85 | v96.01,48.13 95.53,47.65 XO301.2 94.84,47.65 v94.36,48.13 | R312.1 98.94,46.1 v98.55,46.1 | R504.1 166.12,70.61 v165.86,70.87 | R508.1 166.12,65.15 v165.74,65.53 | D501.2 162.69,66.04 v162.31,66.42 | U501.2 v154.56,68.45 | C503.2 v152.65,67.82 | C505.2 v152.65,61.72 | U503.2 v154.56,62.36 | R511.1 166.12,58.67 v165.86,58.93 | U505.5 v159.26,57.02 | R514.1 167.27,53.09 J504.G@1 | v162.94,37.72 D202.2 | J204.1 v66.04,24.51 | J204.3 v64.77,24.51 | J204.5 v63.5,24.51 | J204.7 v62.23,21.34 | X201.2 74.93,22.94 v74.93,21.97 | X201.4 76.71,25.32 v76.71,26.42 | C206.2 v77.98,25.4 76.83,25.4 76.71,25.27 | C205.2 v73.53,26.42 | D502.2 v162.69,54.23 | v85.09,35.05 86.29,35.05 C915.2 86.43,35.05 v87.63,35.05 | LED301.C 127.52,1.52 v128.4,1.52 129.27,1.52 LED302.C | LED303.C 131.08,1.52 v131.95,1.52 132.83,1.52 LED304.C | R517.1 62.1,6.47 v62.1,5.71 | U201.PAD v74.17,15.24 | R807.2 v17.14,53.59 | J401.A1 v5.71,83.57 | J401.B1 v5.71,80.52
  Top 0.305: J401.B2 v6.99,80.52 | J401.B3 v8.26,80.52 | J401.A9 v15.88,83.44 | J401.A12 v19.68,83.44 | J401.A13 v20.95,83.44 | J401.A14 v22.23,83.44 | J401.A15 v23.5,83.44 | J401.A16 v24.77,83.44 | J401.A17 v26.04,83.44 | J401.A19 v28.57,83.44 | J401.B17 v26.04,80.52 | J402.A4 v43.81,83.44 | J402.B4 v43.81,80.52 | J402.B3 v42.55,80.52 | J402.A1 v40.01,83.44 | J402.A8 v48.9,83.44 | J402.B8 v48.9,80.52 | J402.A12 v53.98,83.44 | J402.A13 v55.24,83.44 | J402.A14 v56.52,83.44 | J402.A15 v57.78,83.44 | J402.B12 v53.98,80.52 | J402.B17 v60.33,80.52 | J402.A17 v60.33,83.44 | J402.A19 v62.87,83.44 | J403.A1 v74.3,83.44 | J403.A4 v78.11,83.44 | J403.B4 v78.11,80.52 | J403.B3 v76.83,80.52 | J403.A8 v83.19,83.44 | J403.B8 v83.19,80.52 | J403.A12 v88.27,83.44 | J403.A13 v89.53,83.44 | J403.A14 v90.81,83.44 | J403.A15 v92.08,83.44 | J403.B12 v88.27,80.52 | J403.A17 v94.61,83.44 | J403.B17 v94.61,80.52 | J403.A19 v97.16,83.44 | J404.A1 v108.58,83.44 | J404.A4 v112.39,83.44 | J404.B3 v111.12,80.52 | J404.B4 v112.39,80.52 | J404.A8 v117.47,83.44 | J404.B8 v117.47,80.52 | J404.A12 v122.56,83.44 | J404.B12 v122.56,80.52 | J404.A13 v123.83,83.44 | J404.A14 v125.09,83.44 | J404.A15 v126.36,83.44 | J404.A17 v128.91,83.44 | J404.B17 v128.91,80.52 | J404.A19 v131.44,83.44 | J405.A1 v142.88,83.44 | J405.A4 v146.69,83.44 | J405.B3 v145.41,80.52 | J405.B4 146.56,81.19 v146.56,80.52 | J405.A8 v151.76,83.44 | J405.B8 v151.76,80.52 | J405.A12 v156.84,83.44 | J405.B12 v156.84,80.52 | J405.A13 v158.12,83.44 | J405.A14 v159.38,83.44 | J405.A15 v160.66,83.44 | J405.A17 v163.19,83.44 | J405.B17 v163.19,80.52 | J405.A19 v165.74,83.44 | J601.2 v103,38.1 | J601.4 v103,36.83 | J601.6 v103,35.56 | J601.1 v95.12,38.1 | J601.21 v95.12,25.4
  Top 0.305: J601.25 v95.12,22.86 | J601.24 v103,24.13 | J301.1 v112.65,37.97 | J301.3 v112.65,36.7 | J301.5 v112.65,35.43 | J301.7 v112.65,34.16 | J303.1 v119.51,49.91 | J303.3 v119.51,48.64 | J303.5 v119.51,47.37 | J303.7 v119.51,46.1 | J303.9 v119.51,44.83 | v155.07,43.94 C604.2 | D101.2 v162.94,45.72 | J102.1 167.21,42.93 v168.53,42.93 | J202.1 167.21,35.05 v168.53,35.05 | C506.2 v149.1,60.58 | U504.3 v152.4,58.42 | J602.7 v72.39,49.15 | J602.5 v76.2,47.88 | J602.3 v72.39,46.61 | J602.1 v75.56,45.34 | J205.7 v82.55,30.35 | J205.5 v83.82,30.35 | J205.3 v85.09,30.35 | J205.1 v86.36,30.35 | J601.17 v95.12,27.94 | LS601.2 v140.08,3.17 | J203.SH5 J203.SH6 | J203.SH4 J203.SH3 | v6.22,25.4 6.22,26.87 C718.N | v6.22,28.45 6.22,26.92 | v10.41,26.92 6.22,26.92 | v2.16,26.92 6.22,26.92